# Altium project Capstone_Mainboard.PrjPcb (part 1 of 2)
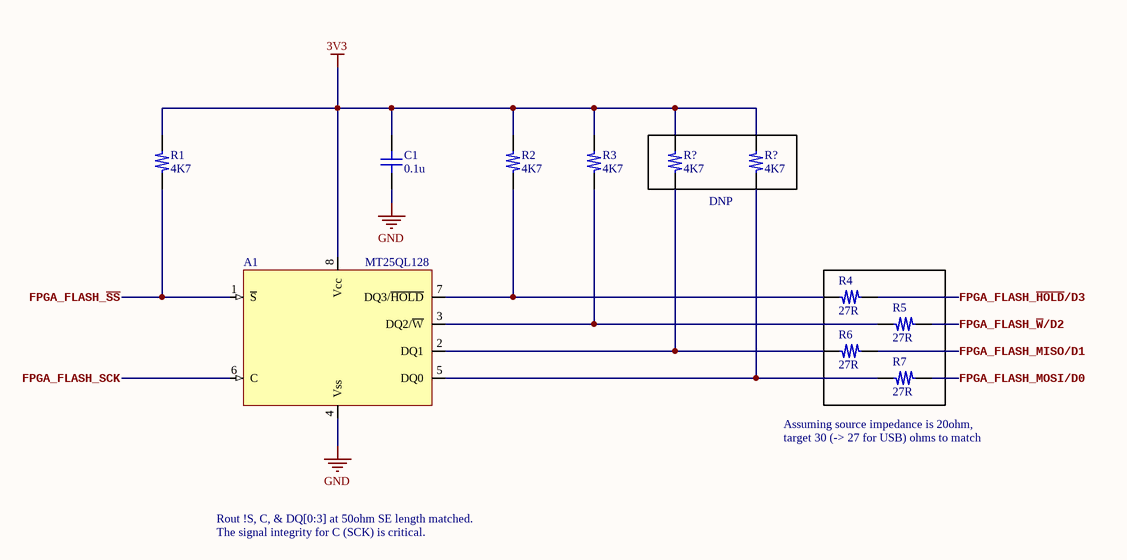
[diagram p0: FPGA_FLASH.SchDoc]
11 sheets, 95 parts. Net scope: global (net labels, ports and power ports of the same name join across sheets).
Board file: Main_PCB.PcbDoc
Sheets:
  FPGA_FLASH.SchDoc
  I2C_Switch_I2C_EEPROM.SchDoc
  QSFP_Cages_Connectors.SchDoc
  HPCC_Connector_A.SchDoc
  HPCC_Connector_B.SchDoc
  FPGA_Power.SchDoc
  FPGA_Configuration_JTAG.SchDoc
  FPGA_HPCC_B_BG13-15-16.SchDoc
  FPGA_HPCC_A_BG33-34-35.SchDoc
  FPGA_GTXqs.SchDoc
  Misc_Functions.SchDoc

## Sheet FPGA_FLASH.SchDoc
size B; SheetNumber: 1; SheetTotal: 11

### Parts
(Parts that share a designator on the sheet are numbered #1, #2 ... from top to bottom, then left to right.)
A1  MT25QL128  [LOTES_ACA-SPI-004-K01]
C1  0.1u  [C_0402_Generic]
R1  4K7  [R_0402_Generic]
R2  4K7  [R_0402_Generic]
R3  4K7  [R_0402_Generic]
R4  27R  [R_0402_Generic]
R5  27R  [R_0402_Generic]
R6  27R  [R_0402_Generic]
R7  27R  [R_0402_Generic]
R?#1  4K7  [R_0402_Generic]
R?#2  4K7  [R_0402_Generic]

### Nets
3V3: A1.8(Vcc) C1.2 R1.2 R2.2 R3.2 R?#1.2 R?#2.2
GND: A1.4(Vss) C1.1
FPGA_FLASH_~{HOLD}/D3: R4.1
FPGA_FLASH_MISO/D1: R6.1
FPGA_FLASH_MOSI/D0: R7.1
FPGA_FLASH_~{SS}: A1.1(~{S}) R1.1
FPGA_FLASH_SCK: A1.6(C)
FPGA_FLASH_~{W}/D2: R5.1
NetA1_2: A1.2(DQ1) R6.2 R?#1.1
NetA1_3: A1.3(DQ2/~{W}) R3.1 R5.2
NetA1_5: A1.5(DQ0) R7.2 R?#2.1
NetA1_7: A1.7(DQ3/~{HOLD}) R2.1 R4.2

### Notes on the sheet
- (near R?#2) DNP
- (near R7) Assuming source impedance is 20ohm,
- target 30 (-> 27 for USB) ohms to match
- Rout !S, C, & DQ[0:3] at 50ohm SE length matched.
- The signal integrity for C (SCK) is critical.

### Library data of the parts
A1 = MT25QL128ABA1ESE_ACA-SPI-004: FLASH - NOR Memory IC 128Mbit SPI (Q)SPI 133 MHz 8-SO In ACA-SPI-004-K01 socket; Manufacturer: Micron Technology Inc; Manufacturer Part Number: MT25QL128ABA1ESE; Manufacturer2: LOTES; Manufacturer2 Part Number: ACA-SPI-004-K01
C1 = GRM155R71C104KA88D: 0.1µF 16V X7R SMD ceramic capacitor in 0402 size; Manufacturer: Murata Electronics; Manufacturer Part Number: GRM155R71C104KA88D
R1-R3 R?#1 R?#2 = ERJ-2RKF4701X: 4.7KOhm 1% 1/10W SMD resistor in 0402 size; Manufacturer: Panasonic; Manufacturer Part Number: ERJ-2RKF4701X
R4-R7 = ERJ-2RKF27R0X: 27Ohm 1% 1/10W SMD resistor in 0402 size; Manufacturer: Panasonic; Manufacturer Part Number: ERJ-2RKF27R0X

## Sheet I2C_Switch_I2C_EEPROM.SchDoc
size B; SheetNumber: 2; SheetTotal: 11
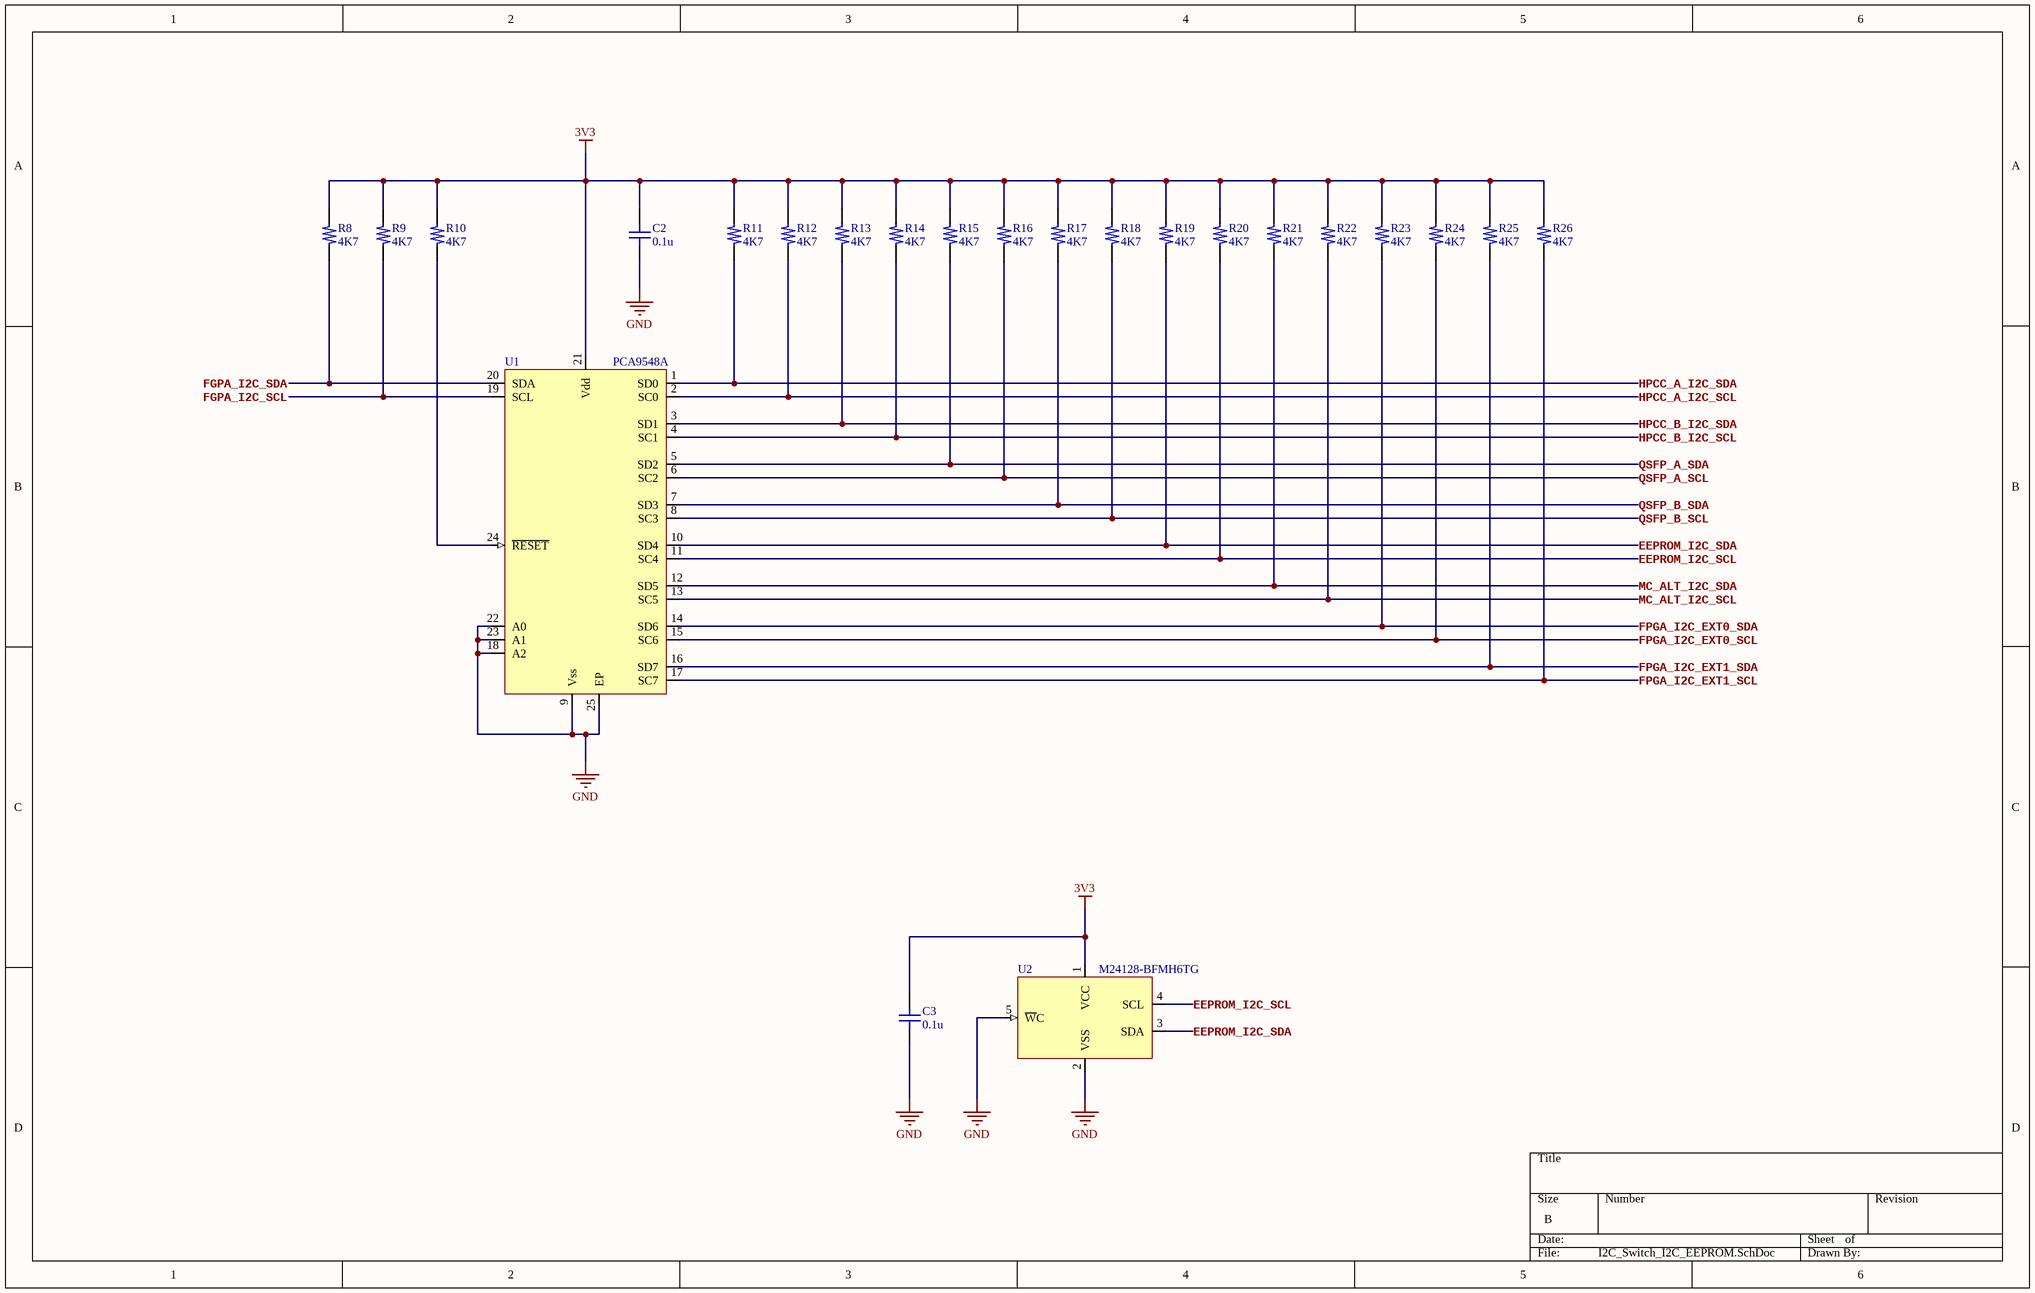
[diagram p1: I2C_Switch_I2C_EEPROM.SchDoc]

### Parts
C2  0.1u  [C_0402_Generic]
C3  0.1u  [C_0402_Generic]
R8  4K7  [R_0402_Generic]
R9  4K7  [R_0402_Generic]
R10  4K7  [R_0402_Generic]
R11  4K7  [R_0402_Generic]
R12  4K7  [R_0402_Generic]
R13  4K7  [R_0402_Generic]
R14  4K7  [R_0402_Generic]
R15  4K7  [R_0402_Generic]
R16  4K7  [R_0402_Generic]
R17  4K7  [R_0402_Generic]
R18  4K7  [R_0402_Generic]
R19  4K7  [R_0402_Generic]
R20  4K7  [R_0402_Generic]
R21  4K7  [R_0402_Generic]
R22  4K7  [R_0402_Generic]
R23  4K7  [R_0402_Generic]
R24  4K7  [R_0402_Generic]
R25  4K7  [R_0402_Generic]
R26  4K7  [R_0402_Generic]
U1  PCA9548A  [HVQFN24_NXP]
U2  M24128-BFMH6TG  [STM_DFN5]

### Nets
3V3: C2.2 C3.2 R8.2 R9.2 R10.2 R11.2 R12.2 R13.2 R14.2 R15.2 R16.2 R17.2 R18.2 R19.2 R20.2 R21.2 R22.2 R23.2 R24.2 R25.2 R26.2 U1.21(Vdd) U2.1(VCC)
GND: C2.1 C3.1 U1.9(Vss) U1.18(A2) U1.22(A0) U1.23(A1) U1.25(EP) U2.2(VSS) U2.5(~{W}C)
EEPROM_I2C_SCL: R20.1 U1.11(SC4) U2.4(SCL)
EEPROM_I2C_SDA: R19.1 U1.10(SD4) U2.3(SDA)
FGPA_I2C_SCL: R9.1 U1.19(SCL)
FGPA_I2C_SDA: R8.1 U1.20(SDA)
FPGA_I2C_EXT0_SCL: R24.1 U1.15(SC6)
FPGA_I2C_EXT0_SDA: R23.1 U1.14(SD6)
FPGA_I2C_EXT1_SCL: R26.1 U1.17(SC7)
FPGA_I2C_EXT1_SDA: R25.1 U1.16(SD7)
HPCC_A_I2C_SCL: R12.1 U1.2(SC0)
HPCC_A_I2C_SDA: R11.1 U1.1(SD0)
HPCC_B_I2C_SCL: R14.1 U1.4(SC1)
HPCC_B_I2C_SDA: R13.1 U1.3(SD1)
MC_ALT_I2C_SCL: R22.1 U1.13(SC5)
MC_ALT_I2C_SDA: R21.1 U1.12(SD5)
QSFP_A_SCL: R16.1 U1.6(SC2)
QSFP_A_SDA: R15.1 U1.5(SD2)
QSFP_B_SCL: R18.1 U1.8(SC3)
QSFP_B_SDA: R17.1 U1.7(SD3)
NetR10_1: R10.1 U1.24(~{RESET})

### Library data of the parts
C2 C3 = GRM155R71C104KA88D: as C1 on sheet FPGA_FLASH; Manufacturer Part Number: GRM155R71C104KA88D
R8-R26 = ERJ-2RKF4701X: as R1 on sheet FPGA_FLASH; Manufacturer Part Number: ERJ-2RKF4701X
U1 = PCA9548ABS,118: 8-channel I 2 C-bus switch, 24-HVQFN; Manufacturer: NXP; Manufacturer Part Number: PCA9548ABS,118
U2 = M24128-BFMH6TG: EEPROM 128Kbit I2C 1MHz 450 ns; Manufacturer: STMicroelectronics; Manufacturer Part Number: M24128-BFMH6TG

## Sheet QSFP_Cages_Connectors.SchDoc
size B; SheetNumber: 3; SheetTotal: 11
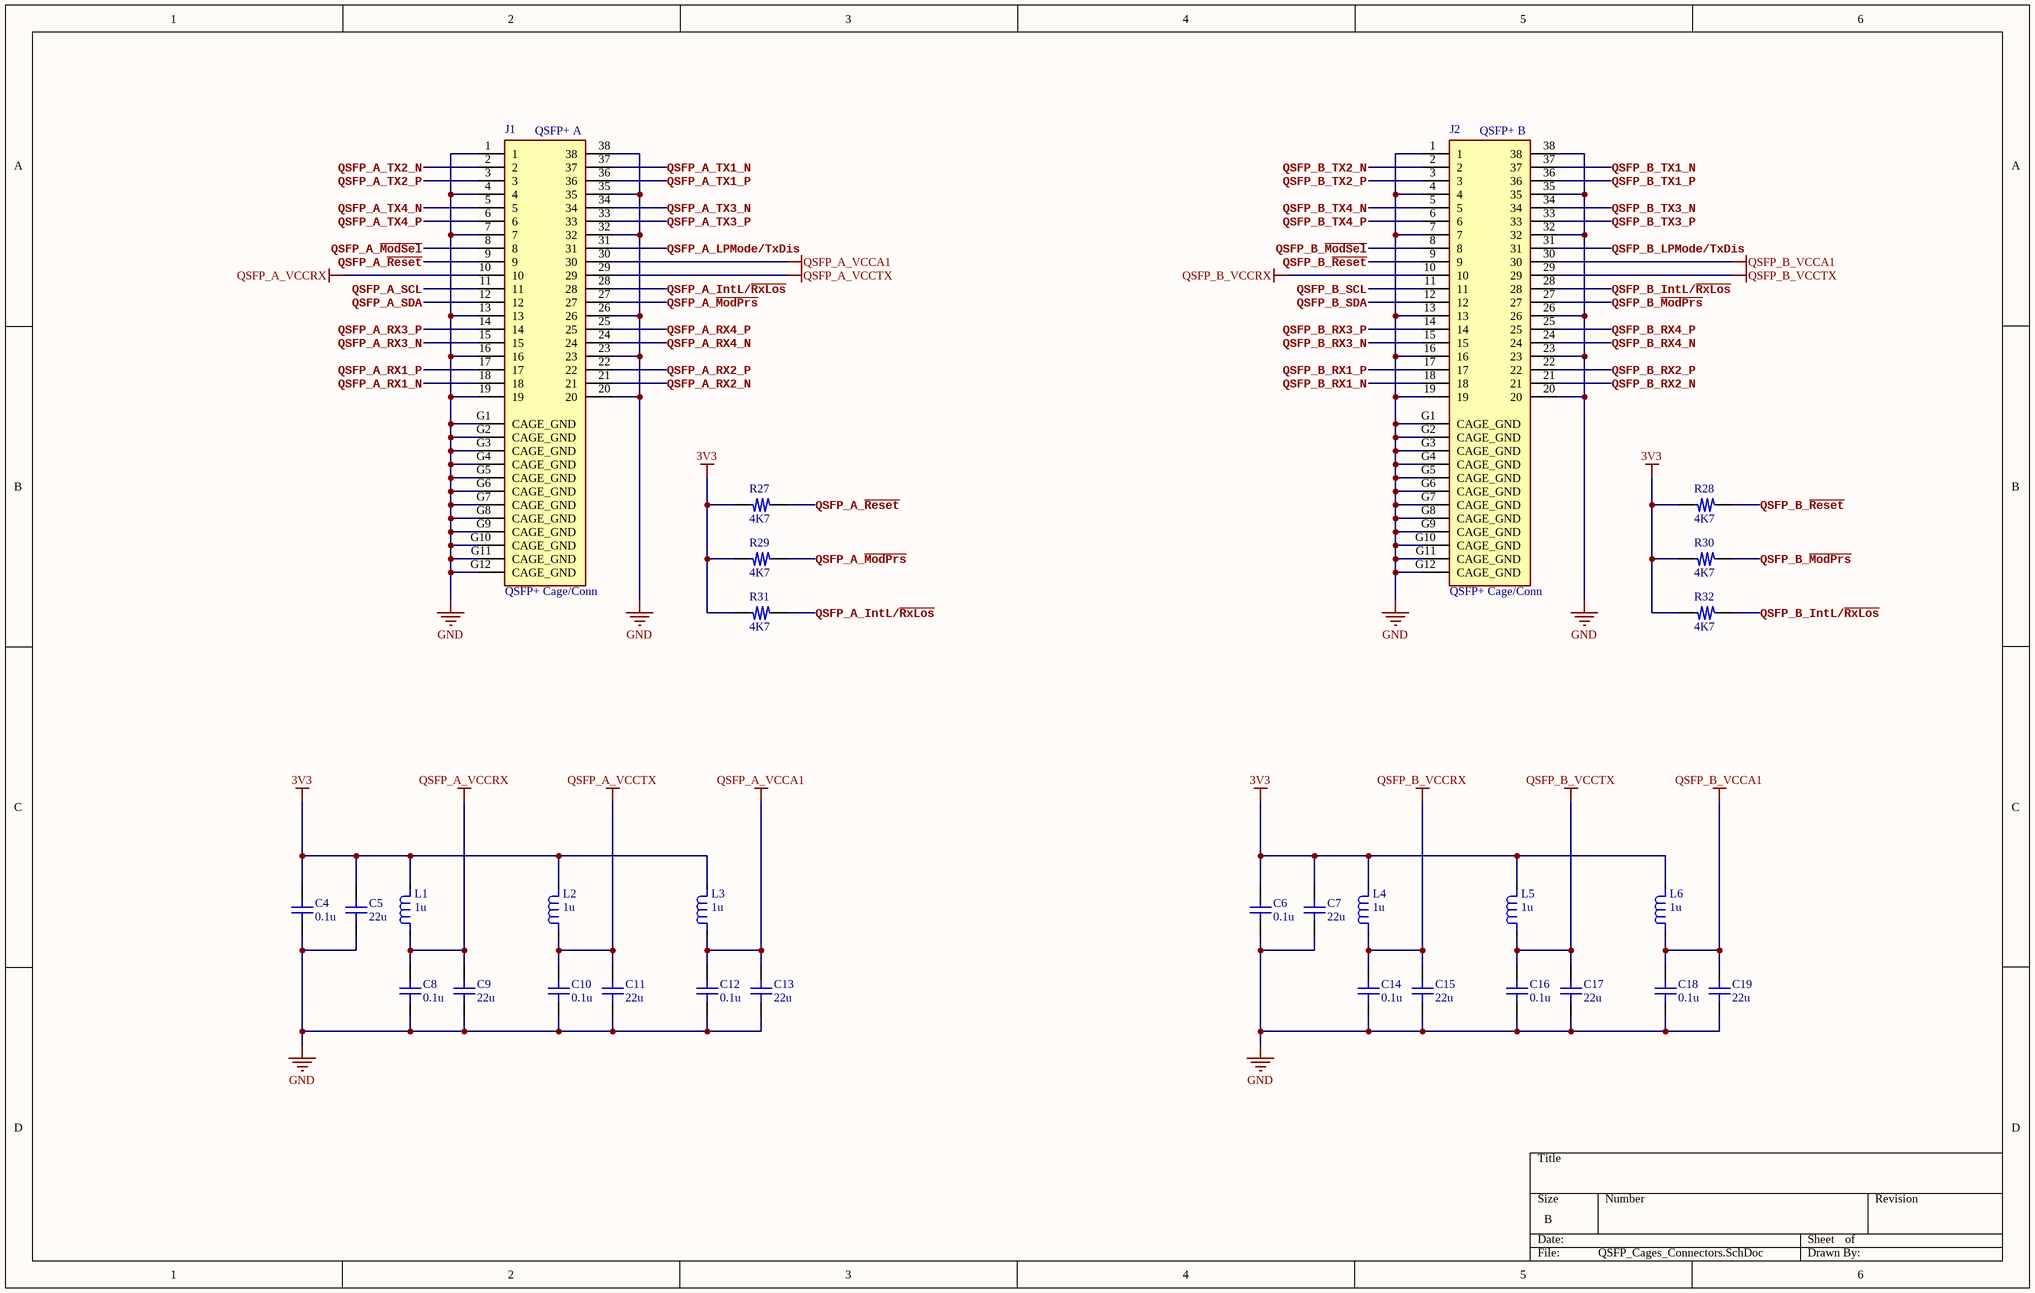
[diagram p2: QSFP_Cages_Connectors.SchDoc]

### Parts
C4  0.1u  [C_0402_Generic]
C5  22u  [C_0603_Generic]
C6  0.1u  [C_0402_Generic]
C7  22u  [C_0603_Generic]
C8  0.1u  [C_0402_Generic]
C9  22u  [C_0603_Generic]
C10  0.1u  [C_0402_Generic]
C11  22u  [C_0603_Generic]
C12  0.1u  [C_0402_Generic]
C13  22u  [C_0603_Generic]
C14  0.1u  [C_0402_Generic]
C15  22u  [C_0603_Generic]
C16  0.1u  [C_0402_Generic]
C17  22u  [C_0603_Generic]
C18  0.1u  [C_0402_Generic]
C19  22u  [C_0603_Generic]
J1  QSFP+ Cage/Conn  [AMPHENOL_U95T151100A]
J2  QSFP+ Cage/Conn  [AMPHENOL_U95T151100A]
L1  1u  [Murata_Ind_1008]
L2  1u  [Murata_Ind_1008]
L3  1u  [Murata_Ind_1008]
L4  1u  [Murata_Ind_1008]
L5  1u  [Murata_Ind_1008]
L6  1u  [Murata_Ind_1008]
R27  4K7  [R_0402_Generic]
R28  4K7  [R_0402_Generic]
R29  4K7  [R_0402_Generic]
R30  4K7  [R_0402_Generic]
R31  4K7  [R_0402_Generic]
R32  4K7  [R_0402_Generic]

### Nets
3V3: C4.2 C5.2 C6.2 C7.2 L1.1 L2.1 L3.1 L4.1 L5.1 L6.1 R27.2 R28.2 R29.2 R30.2 R31.2 R32.2
GND: C4.1 C5.1 C6.1 C7.1 C8.1 C9.1 C10.1 C11.1 C12.1 C13.1 C14.1 C15.1 C16.1 C17.1 C18.1 C19.1 J1.1 J1.4 J1.7 J1.13 J1.16 J1.19 J1.20 J1.23 J1.26 J1.32 J1.35 J1.38 J1.G1(CAGE_GND) J1.G2(CAGE_GND) J1.G3(CAGE_GND) J1.G4(CAGE_GND) J1.G5(CAGE_GND) J1.G6(CAGE_GND) J1.G7(CAGE_GND) J1.G8(CAGE_GND) J1.G9(CAGE_GND) J1.G10(CAGE_GND) J1.G11(CAGE_GND) J1.G12(CAGE_GND) J2.1 J2.4 J2.7 J2.13 J2.16 J2.19 J2.20 J2.23 J2.26 J2.32 J2.35 J2.38 J2.G1(CAGE_GND) J2.G2(CAGE_GND) J2.G3(CAGE_GND) J2.G4(CAGE_GND) J2.G5(CAGE_GND) J2.G6(CAGE_GND) J2.G7(CAGE_GND) J2.G8(CAGE_GND) J2.G9(CAGE_GND) J2.G10(CAGE_GND) J2.G11(CAGE_GND) J2.G12(CAGE_GND)
QSFP_A_VCCA1: C12.2 C13.2 J1.30 L3.2
QSFP_A_VCCRX: C8.2 C9.2 J1.10 L1.2
QSFP_A_VCCTX: C10.2 C11.2 J1.29 L2.2
QSFP_B_VCCA1: C18.2 C19.2 J2.30 L6.2
QSFP_B_VCCRX: C14.2 C15.2 J2.10 L4.2
QSFP_B_VCCTX: C16.2 C17.2 J2.29 L5.2
QSFP_A_IntL/~{RxLos}: J1.28 R31.1
QSFP_A_LPMode/TxDis: J1.31
QSFP_A_~{ModPrs}: J1.27 R29.1
QSFP_A_~{ModSel}: J1.8
QSFP_A_~{Reset}: J1.9 R27.1
QSFP_A_RX1_N: J1.18
QSFP_A_RX1_P: J1.17
QSFP_A_RX2_N: J1.21
QSFP_A_RX2_P: J1.22
QSFP_A_RX3_N: J1.15
QSFP_A_RX3_P: J1.14
QSFP_A_RX4_N: J1.24
QSFP_A_RX4_P: J1.25
QSFP_A_SCL: J1.11
QSFP_A_SDA: J1.12
QSFP_A_TX1_N: J1.37
QSFP_A_TX1_P: J1.36
QSFP_A_TX2_N: J1.2
QSFP_A_TX2_P: J1.3
QSFP_A_TX3_N: J1.34
QSFP_A_TX3_P: J1.33
QSFP_A_TX4_N: J1.5
QSFP_A_TX4_P: J1.6
QSFP_B_IntL/~{RxLos}: J2.28 R32.1
QSFP_B_LPMode/TxDis: J2.31
QSFP_B_~{ModPrs}: J2.27 R30.1
QSFP_B_~{ModSel}: J2.8
QSFP_B_~{Reset}: J2.9 R28.1
QSFP_B_RX1_N: J2.18
QSFP_B_RX1_P: J2.17
QSFP_B_RX2_N: J2.21
QSFP_B_RX2_P: J2.22
QSFP_B_RX3_N: J2.15
QSFP_B_RX3_P: J2.14
QSFP_B_RX4_N: J2.24
QSFP_B_RX4_P: J2.25
QSFP_B_SCL: J2.11
QSFP_B_SDA: J2.12
QSFP_B_TX1_N: J2.37
QSFP_B_TX1_P: J2.36
QSFP_B_TX2_N: J2.2
QSFP_B_TX2_P: J2.3
QSFP_B_TX3_N: J2.34
QSFP_B_TX3_P: J2.33
QSFP_B_TX4_N: J2.5
QSFP_B_TX4_P: J2.6

### Notes on the sheet
- (near J1) QSFP+ A
- (near J2) QSFP+ B

### Library data of the parts
C4 C6 C8 C10 C12 C14 C16 C18 = GRM155R71C104KA88D: as C1 on sheet FPGA_FLASH; Manufacturer Part Number: GRM155R71C104KA88D
C5 C7 C9 C11 C13 C15 C17 C19 = GRM188R60J226MEA0D: 22µF 6.3V X5R SMD ceramic capacitor in 0603 size; Manufacturer: Murata Electronics; Manufacturer Part Number: GRM188R60J226MEA0D
J1 J2 = U95T151100A: NOTE: Notes Also uses one FS1-Z38-20Z6-60. 38 Position QSFP+ Receptacle; MF: Amphenol; Package: None; Availability: In Stock; SnapEDA_Link: https://www.snapeda.com/parts/U95T151100A/Amphenol/view-part/?ref=snap; MP: U95T151100A; Price: None; Check_prices: https://www.snapeda.com/parts/U95T151100A/Amphenol/view-part/?ref=eda; Purchase-URL: https://pricing.snapeda.com/search/part/U95T151100A/?ref=eda; Value: *
L1-L6 = DFE252012F-1R0M=P2: 1µH Shielded 3.3A 40mOhm 1008 Inductor; Manufacturer: Murata Electronics; Manufacturer Part Number: DFE252012F-1R0M=P2
R27-R32 = ERJ-2RKF4701X: as R1 on sheet FPGA_FLASH; Manufacturer Part Number: ERJ-2RKF4701X

## Sheet HPCC_Connector_A.SchDoc
size B; SheetNumber: 4; SheetTotal: 11
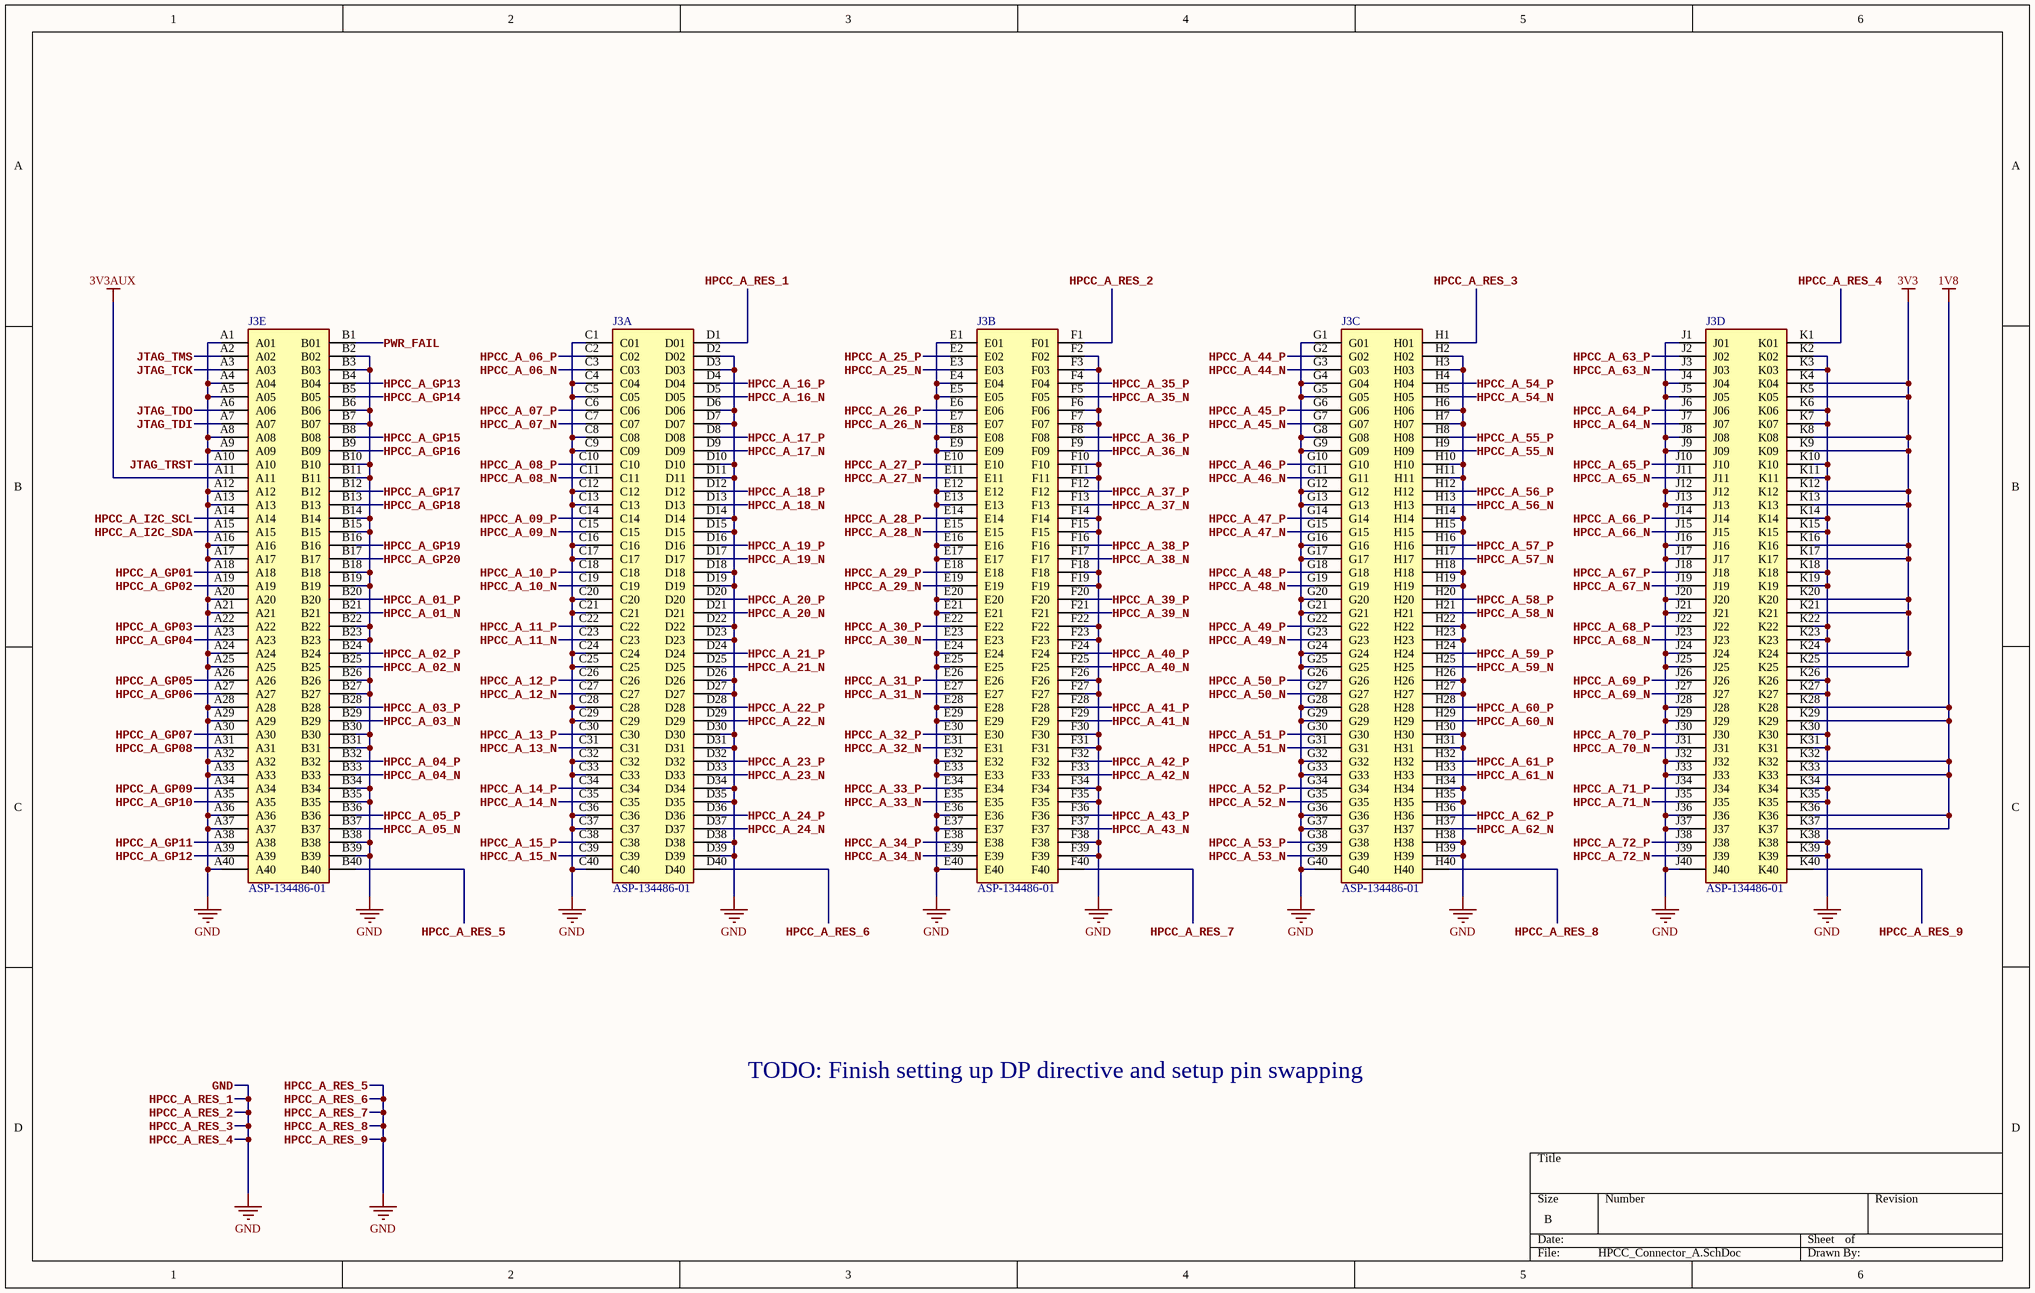
[diagram p3: HPCC_Connector_A.SchDoc]

### Parts
J3  ASP-134486-01  [SAMTEC_ASP-134486-01]  (parts A,B,C,D,E of 5)

### Nets
1V8: J3.K28 J3.K29 J3.K32 J3.K33 J3.K36 J3.K37
3V3: J3.K4(K04) J3.K5(K05) J3.K8(K08) J3.K9(K09) J3.K12 J3.K13 J3.K16 J3.K17 J3.K20 J3.K21 J3.K24 J3.K25
3V3AUX: J3.A11
GND: J3.A1(A01) J3.A4(A04) J3.A5(A05) J3.A8(A08) J3.A9(A09) J3.A12 J3.A13 J3.A16 J3.A17 J3.A20 J3.A21 J3.A24 J3.A25 J3.A28 J3.A29 J3.A32 J3.A33 J3.A36 J3.A37 J3.A40 J3.B2(B02) J3.B3(B03) J3.B6(B06) J3.B7(B07) J3.B10 J3.B11 J3.B14 J3.B15 J3.B18 J3.B19 J3.B22 J3.B23 J3.B26 J3.B27 J3.B30 J3.B31 J3.B34 J3.B35 J3.B38 J3.B39 J3.B40 J3.C1(C01) J3.C4(C04) J3.C5(C05) J3.C8(C08) J3.C9(C09) J3.C12 J3.C13 J3.C16 J3.C17 J3.C20 J3.C21 J3.C24 J3.C25 J3.C28 J3.C29 J3.C32 J3.C33 J3.C36 J3.C37 J3.C40 J3.D1(D01) J3.D2(D02) J3.D3(D03) J3.D6(D06) J3.D7(D07) J3.D10 J3.D11 J3.D14 J3.D15 J3.D18 J3.D19 J3.D22 J3.D23 J3.D26 J3.D27 J3.D30 J3.D31 J3.D34 J3.D35 J3.D38 J3.D39 J3.D40 J3.E1(E01) J3.E4(E04) J3.E5(E05) J3.E8(E08) J3.E9(E09) J3.E12 J3.E13 J3.E16 J3.E17 J3.E20 J3.E21 J3.E24 J3.E25 J3.E28 J3.E29 J3.E32 J3.E33 J3.E36 J3.E37 J3.E40 J3.F1(F01) J3.F2(F02) J3.F3(F03) J3.F6(F06) J3.F7(F07) J3.F10 J3.F11 J3.F14 J3.F15 J3.F18 J3.F19 J3.F22 J3.F23 J3.F26 J3.F27 J3.F30 J3.F31 J3.F34 J3.F35 J3.F38 J3.F39 J3.F40 J3.G1(G01) J3.G4(G04) J3.G5(G05) J3.G8(G08) J3.G9(G09) J3.G12 J3.G13 J3.G16 J3.G17 J3.G20 J3.G21 J3.G24 J3.G25 J3.G28 J3.G29 J3.G32 J3.G33 J3.G36 J3.G37 J3.G40 J3.H1(H01) J3.H2(H02) J3.H3(H03) J3.H6(H06) J3.H7(H07) J3.H10 J3.H11 J3.H14 J3.H15 J3.H18 J3.H19 J3.H22 J3.H23 J3.H26 J3.H27 J3.H30 J3.H31 J3.H34 J3.H35 J3.H38 J3.H39 J3.H40 J3.J1(J01) J3.J4(J04) J3.J5(J05) J3.J8(J08) J3.J9(J09) J3.J12 J3.J13 J3.J16 J3.J17 J3.J20 J3.J21 J3.J24 J3.J25 J3.J28 J3.J29 J3.J32 J3.J33 J3.J36 J3.J37 J3.J40 J3.K1(K01) J3.K2(K02) J3.K3(K03) J3.K6(K06) J3.K7(K07) J3.K10 J3.K11 J3.K14 J3.K15 J3.K18 J3.K19 J3.K22 J3.K23 J3.K26 J3.K27 J3.K30 J3.K31 J3.K34 J3.K35 J3.K38 J3.K39 J3.K40  [also labelled HPCC_A_RES_1, HPCC_A_RES_2, HPCC_A_RES_3, HPCC_A_RES_4, HPCC_A_RES_5, HPCC_A_RES_6, HPCC_A_RES_7, HPCC_A_RES_8, HPCC_A_RES_9]
HPCC_A_01_N: J3.B21
HPCC_A_01_P: J3.B20
HPCC_A_02_N: J3.B25
HPCC_A_02_P: J3.B24
HPCC_A_03_N: J3.B29
HPCC_A_03_P: J3.B28
HPCC_A_04_N: J3.B33
HPCC_A_04_P: J3.B32
HPCC_A_05_N: J3.B37
HPCC_A_05_P: J3.B36
HPCC_A_06_N: J3.C3(C03)
HPCC_A_06_P: J3.C2(C02)
HPCC_A_07_N: J3.C7(C07)
HPCC_A_07_P: J3.C6(C06)
HPCC_A_08_N: J3.C11
HPCC_A_08_P: J3.C10
HPCC_A_09_N: J3.C15
HPCC_A_09_P: J3.C14
HPCC_A_10_N: J3.C19
HPCC_A_10_P: J3.C18
HPCC_A_11_N: J3.C23
HPCC_A_11_P: J3.C22
HPCC_A_12_N: J3.C27
HPCC_A_12_P: J3.C26
HPCC_A_13_N: J3.C31
HPCC_A_13_P: J3.C30
HPCC_A_14_N: J3.C35
HPCC_A_14_P: J3.C34
HPCC_A_15_N: J3.C39
HPCC_A_15_P: J3.C38
HPCC_A_16_N: J3.D5(D05)
HPCC_A_16_P: J3.D4(D04)
HPCC_A_17_N: J3.D9(D09)
HPCC_A_17_P: J3.D8(D08)
HPCC_A_18_N: J3.D13
HPCC_A_18_P: J3.D12
HPCC_A_19_N: J3.D17
HPCC_A_19_P: J3.D16
HPCC_A_20_N: J3.D21
HPCC_A_20_P: J3.D20
HPCC_A_21_N: J3.D25
HPCC_A_21_P: J3.D24
HPCC_A_22_N: J3.D29
HPCC_A_22_P: J3.D28
HPCC_A_23_N: J3.D33
HPCC_A_23_P: J3.D32
HPCC_A_24_N: J3.D37
HPCC_A_24_P: J3.D36
HPCC_A_25_N: J3.E3(E03)
HPCC_A_25_P: J3.E2(E02)
HPCC_A_26_N: J3.E7(E07)
HPCC_A_26_P: J3.E6(E06)
HPCC_A_27_N: J3.E11
HPCC_A_27_P: J3.E10
HPCC_A_28_N: J3.E15
HPCC_A_28_P: J3.E14
HPCC_A_29_N: J3.E19
HPCC_A_29_P: J3.E18
HPCC_A_30_N: J3.E23
HPCC_A_30_P: J3.E22
HPCC_A_31_N: J3.E27
HPCC_A_31_P: J3.E26
HPCC_A_32_N: J3.E31
HPCC_A_32_P: J3.E30
HPCC_A_33_N: J3.E35
HPCC_A_33_P: J3.E34
HPCC_A_34_N: J3.E39
HPCC_A_34_P: J3.E38
HPCC_A_35_N: J3.F5(F05)
HPCC_A_35_P: J3.F4(F04)
HPCC_A_36_N: J3.F9(F09)
HPCC_A_36_P: J3.F8(F08)
HPCC_A_37_N: J3.F13
HPCC_A_37_P: J3.F12
HPCC_A_38_N: J3.F17
HPCC_A_38_P: J3.F16
HPCC_A_39_N: J3.F21
HPCC_A_39_P: J3.F20
HPCC_A_40_N: J3.F25
HPCC_A_40_P: J3.F24
HPCC_A_41_N: J3.F29
HPCC_A_41_P: J3.F28
HPCC_A_42_N: J3.F33
HPCC_A_42_P: J3.F32
HPCC_A_43_N: J3.F37
HPCC_A_43_P: J3.F36
HPCC_A_44_N: J3.G3(G03)
HPCC_A_44_P: J3.G2(G02)
HPCC_A_45_N: J3.G7(G07)
HPCC_A_45_P: J3.G6(G06)
HPCC_A_46_N: J3.G11
HPCC_A_46_P: J3.G10
HPCC_A_47_N: J3.G15
HPCC_A_47_P: J3.G14
HPCC_A_48_N: J3.G19
HPCC_A_48_P: J3.G18
HPCC_A_49_N: J3.G23
HPCC_A_49_P: J3.G22
HPCC_A_50_N: J3.G27
HPCC_A_50_P: J3.G26
HPCC_A_51_N: J3.G31
HPCC_A_51_P: J3.G30
HPCC_A_52_N: J3.G35
HPCC_A_52_P: J3.G34
HPCC_A_53_N: J3.G39
HPCC_A_53_P: J3.G38
HPCC_A_54_N: J3.H5(H05)
HPCC_A_54_P: J3.H4(H04)
HPCC_A_55_N: J3.H9(H09)
HPCC_A_55_P: J3.H8(H08)
HPCC_A_56_N: J3.H13
HPCC_A_56_P: J3.H12
HPCC_A_57_N: J3.H17
HPCC_A_57_P: J3.H16
HPCC_A_58_N: J3.H21
HPCC_A_58_P: J3.H20
HPCC_A_59_N: J3.H25
HPCC_A_59_P: J3.H24
HPCC_A_60_N: J3.H29
HPCC_A_60_P: J3.H28
HPCC_A_61_N: J3.H33
HPCC_A_61_P: J3.H32
HPCC_A_62_N: J3.H37
HPCC_A_62_P: J3.H36
HPCC_A_63_N: J3.J3(J03)
HPCC_A_63_P: J3.J2(J02)
HPCC_A_64_N: J3.J7(J07)
HPCC_A_64_P: J3.J6(J06)
HPCC_A_65_N: J3.J11
HPCC_A_65_P: J3.J10
HPCC_A_66_N: J3.J15
HPCC_A_66_P: J3.J14
HPCC_A_67_N: J3.J19
HPCC_A_67_P: J3.J18
HPCC_A_68_N: J3.J23
HPCC_A_68_P: J3.J22
HPCC_A_69_N: J3.J27
HPCC_A_69_P: J3.J26
HPCC_A_70_N: J3.J31
HPCC_A_70_P: J3.J30
HPCC_A_71_N: J3.J35
HPCC_A_71_P: J3.J34
HPCC_A_72_N: J3.J39
HPCC_A_72_P: J3.J38
HPCC_A_GP01: J3.A18
HPCC_A_GP02: J3.A19
HPCC_A_GP03: J3.A22
HPCC_A_GP04: J3.A23
HPCC_A_GP05: J3.A26
HPCC_A_GP06: J3.A27
HPCC_A_GP07: J3.A30
HPCC_A_GP08: J3.A31
HPCC_A_GP09: J3.A34
HPCC_A_GP10: J3.A35
HPCC_A_GP11: J3.A38
HPCC_A_GP12: J3.A39
HPCC_A_GP13: J3.B4(B04)
HPCC_A_GP14: J3.B5(B05)
HPCC_A_GP15: J3.B8(B08)
HPCC_A_GP16: J3.B9(B09)
HPCC_A_GP17: J3.B12
HPCC_A_GP18: J3.B13
HPCC_A_GP19: J3.B16
HPCC_A_GP20: J3.B17
HPCC_A_I2C_SCL: J3.A14
HPCC_A_I2C_SDA: J3.A15
JTAG_TCK: J3.A3(A03)
JTAG_TDI: J3.A7(A07)
JTAG_TDO: J3.A6(A06)
JTAG_TMS: J3.A2(A02)
JTAG_TRST: J3.A10
PWR_FAIL: J3.B1(B01)

### Notes on the sheet
- TODO: Finish setting up DP directive and setup pin swapping

### Library data of the parts
J3 = ASP-134486-01: 400 Position Connector Array, Female Sockets Surface Mount Gold; Manufacturer: Samtec; Manufacturer Part Number: ASP-134486-01

## Sheet HPCC_Connector_B.SchDoc
size B; SheetNumber: 5; SheetTotal: 11
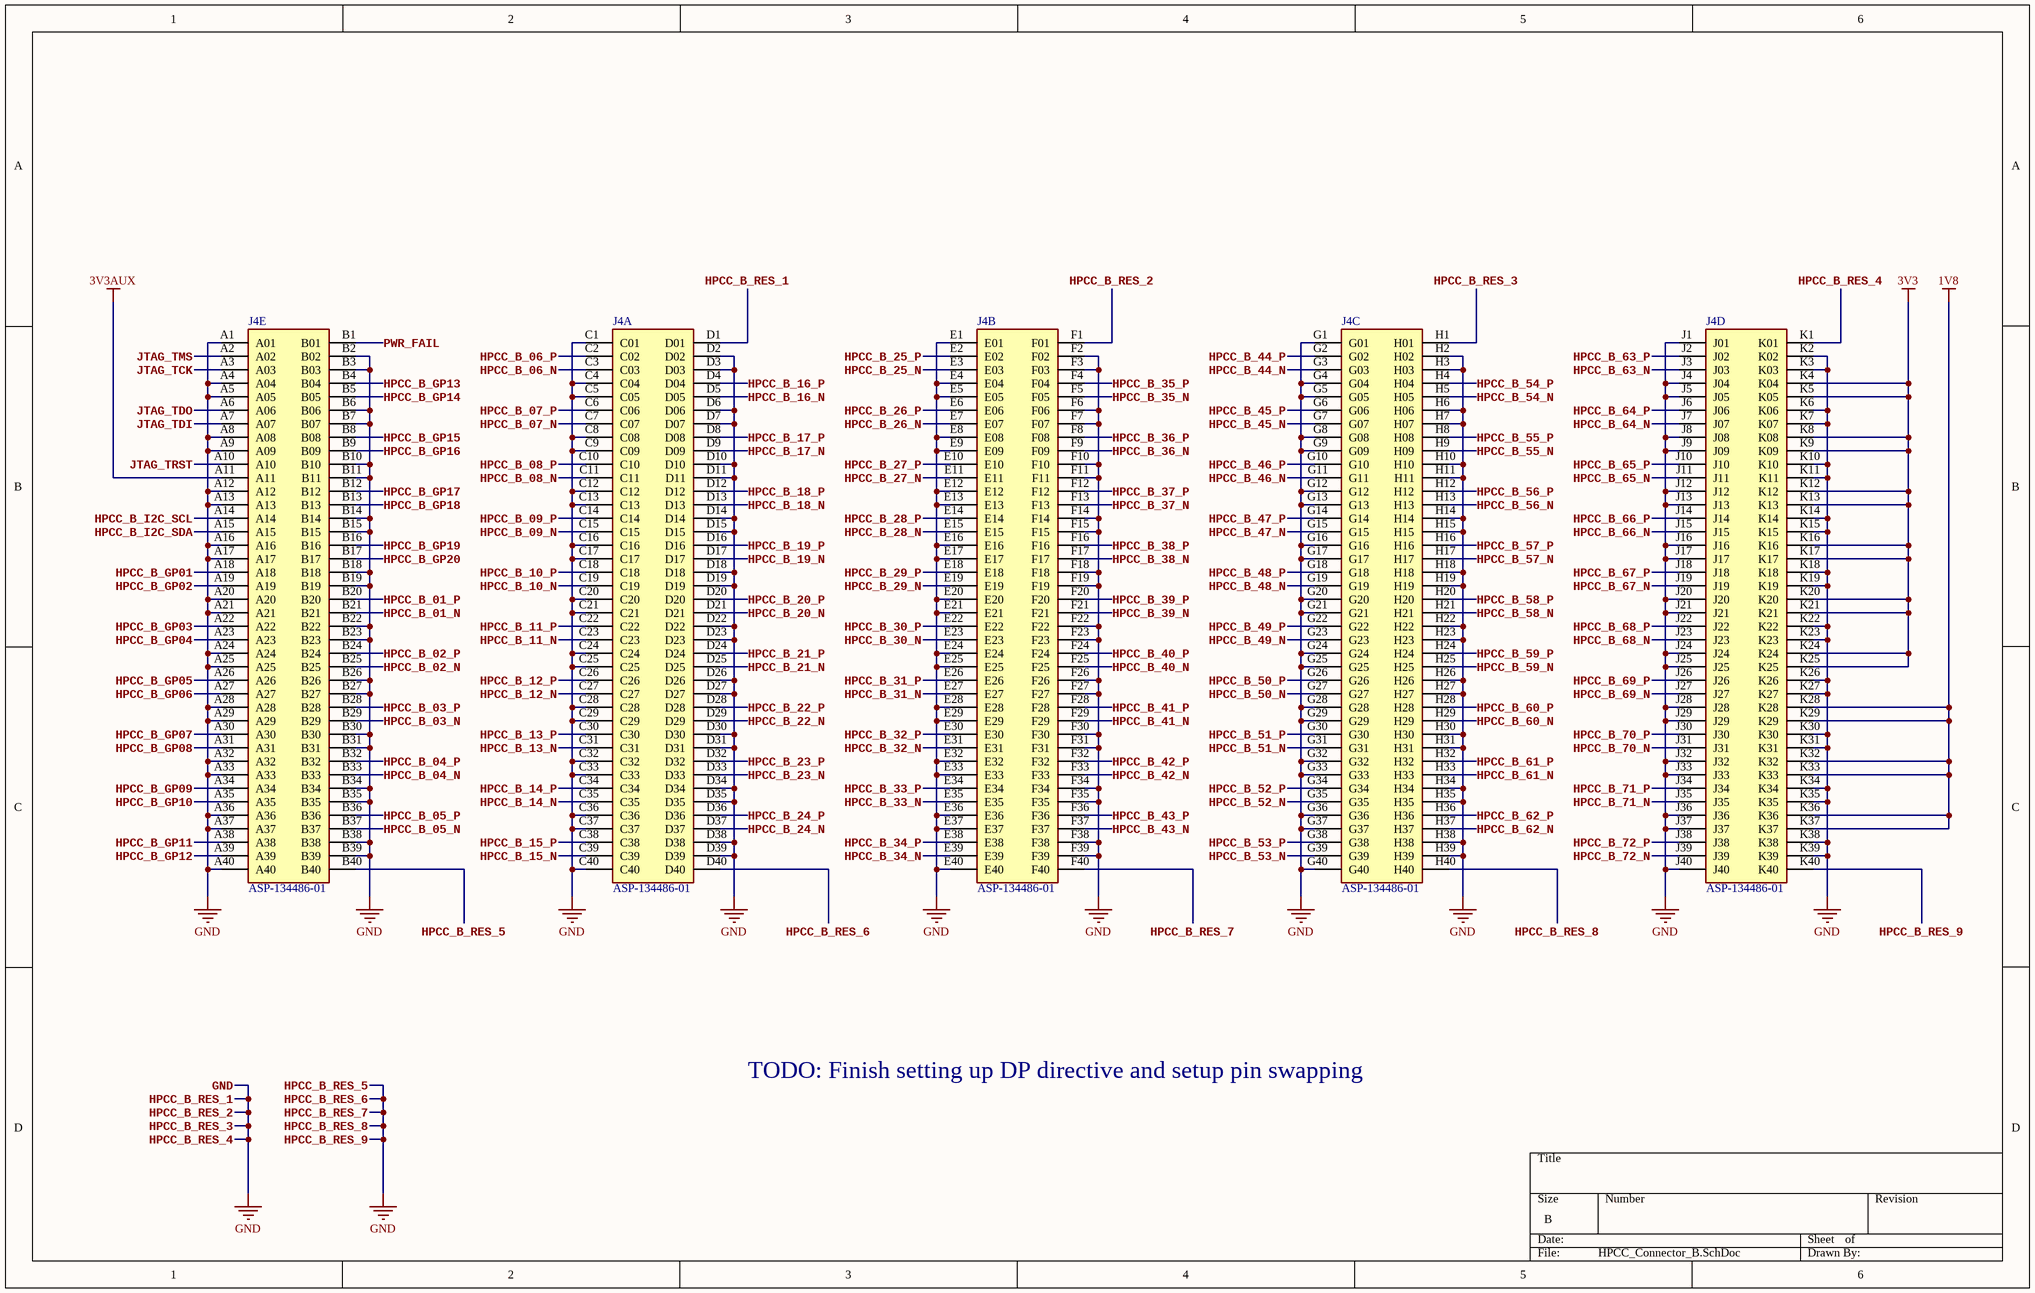
[diagram p4: HPCC_Connector_B.SchDoc]

### Parts
J4  ASP-134486-01  [SAMTEC_ASP-134486-01]  (parts A,B,C,D,E of 5)

### Nets
1V8: J4.K28 J4.K29 J4.K32 J4.K33 J4.K36 J4.K37
3V3: J4.K4(K04) J4.K5(K05) J4.K8(K08) J4.K9(K09) J4.K12 J4.K13 J4.K16 J4.K17 J4.K20 J4.K21 J4.K24 J4.K25
3V3AUX: J4.A11
GND: J4.A1(A01) J4.A4(A04) J4.A5(A05) J4.A8(A08) J4.A9(A09) J4.A12 J4.A13 J4.A16 J4.A17 J4.A20 J4.A21 J4.A24 J4.A25 J4.A28 J4.A29 J4.A32 J4.A33 J4.A36 J4.A37 J4.A40 J4.B2(B02) J4.B3(B03) J4.B6(B06) J4.B7(B07) J4.B10 J4.B11 J4.B14 J4.B15 J4.B18 J4.B19 J4.B22 J4.B23 J4.B26 J4.B27 J4.B30 J4.B31 J4.B34 J4.B35 J4.B38 J4.B39 J4.B40 J4.C1(C01) J4.C4(C04) J4.C5(C05) J4.C8(C08) J4.C9(C09) J4.C12 J4.C13 J4.C16 J4.C17 J4.C20 J4.C21 J4.C24 J4.C25 J4.C28 J4.C29 J4.C32 J4.C33 J4.C36 J4.C37 J4.C40 J4.D1(D01) J4.D2(D02) J4.D3(D03) J4.D6(D06) J4.D7(D07) J4.D10 J4.D11 J4.D14 J4.D15 J4.D18 J4.D19 J4.D22 J4.D23 J4.D26 J4.D27 J4.D30 J4.D31 J4.D34 J4.D35 J4.D38 J4.D39 J4.D40 J4.E1(E01) J4.E4(E04) J4.E5(E05) J4.E8(E08) J4.E9(E09) J4.E12 J4.E13 J4.E16 J4.E17 J4.E20 J4.E21 J4.E24 J4.E25 J4.E28 J4.E29 J4.E32 J4.E33 J4.E36 J4.E37 J4.E40 J4.F1(F01) J4.F2(F02) J4.F3(F03) J4.F6(F06) J4.F7(F07) J4.F10 J4.F11 J4.F14 J4.F15 J4.F18 J4.F19 J4.F22 J4.F23 J4.F26 J4.F27 J4.F30 J4.F31 J4.F34 J4.F35 J4.F38 J4.F39 J4.F40 J4.G1(G01) J4.G4(G04) J4.G5(G05) J4.G8(G08) J4.G9(G09) J4.G12 J4.G13 J4.G16 J4.G17 J4.G20 J4.G21 J4.G24 J4.G25 J4.G28 J4.G29 J4.G32 J4.G33 J4.G36 J4.G37 J4.G40 J4.H1(H01) J4.H2(H02) J4.H3(H03) J4.H6(H06) J4.H7(H07) J4.H10 J4.H11 J4.H14 J4.H15 J4.H18 J4.H19 J4.H22 J4.H23 J4.H26 J4.H27 J4.H30 J4.H31 J4.H34 J4.H35 J4.H38 J4.H39 J4.H40 J4.J1(J01) J4.J4(J04) J4.J5(J05) J4.J8(J08) J4.J9(J09) J4.J12 J4.J13 J4.J16 J4.J17 J4.J20 J4.J21 J4.J24 J4.J25 J4.J28 J4.J29 J4.J32 J4.J33 J4.J36 J4.J37 J4.J40 J4.K1(K01) J4.K2(K02) J4.K3(K03) J4.K6(K06) J4.K7(K07) J4.K10 J4.K11 J4.K14 J4.K15 J4.K18 J4.K19 J4.K22 J4.K23 J4.K26 J4.K27 J4.K30 J4.K31 J4.K34 J4.K35 J4.K38 J4.K39 J4.K40  [also labelled HPCC_B_RES_1, HPCC_B_RES_2, HPCC_B_RES_3, HPCC_B_RES_4, HPCC_B_RES_5, HPCC_B_RES_6, HPCC_B_RES_7, HPCC_B_RES_8, HPCC_B_RES_9]
HPCC_B_01_N: J4.B21
HPCC_B_01_P: J4.B20
HPCC_B_02_N: J4.B25
HPCC_B_02_P: J4.B24
HPCC_B_03_N: J4.B29
HPCC_B_03_P: J4.B28
HPCC_B_04_N: J4.B33
HPCC_B_04_P: J4.B32
HPCC_B_05_N: J4.B37
HPCC_B_05_P: J4.B36
HPCC_B_06_N: J4.C3(C03)
HPCC_B_06_P: J4.C2(C02)
HPCC_B_07_N: J4.C7(C07)
HPCC_B_07_P: J4.C6(C06)
HPCC_B_08_N: J4.C11
HPCC_B_08_P: J4.C10
HPCC_B_09_N: J4.C15
HPCC_B_09_P: J4.C14
HPCC_B_10_N: J4.C19
HPCC_B_10_P: J4.C18
HPCC_B_11_N: J4.C23
HPCC_B_11_P: J4.C22
HPCC_B_12_N: J4.C27
HPCC_B_12_P: J4.C26
HPCC_B_13_N: J4.C31
HPCC_B_13_P: J4.C30
HPCC_B_14_N: J4.C35
HPCC_B_14_P: J4.C34
HPCC_B_15_N: J4.C39
HPCC_B_15_P: J4.C38
HPCC_B_16_N: J4.D5(D05)
HPCC_B_16_P: J4.D4(D04)
HPCC_B_17_N: J4.D9(D09)
HPCC_B_17_P: J4.D8(D08)
HPCC_B_18_N: J4.D13
HPCC_B_18_P: J4.D12
HPCC_B_19_N: J4.D17
HPCC_B_19_P: J4.D16
HPCC_B_20_N: J4.D21
HPCC_B_20_P: J4.D20
HPCC_B_21_N: J4.D25
HPCC_B_21_P: J4.D24
HPCC_B_22_N: J4.D29
HPCC_B_22_P: J4.D28
HPCC_B_23_N: J4.D33
HPCC_B_23_P: J4.D32
HPCC_B_24_N: J4.D37
HPCC_B_24_P: J4.D36
HPCC_B_25_N: J4.E3(E03)
HPCC_B_25_P: J4.E2(E02)
HPCC_B_26_N: J4.E7(E07)
HPCC_B_26_P: J4.E6(E06)
HPCC_B_27_N: J4.E11
HPCC_B_27_P: J4.E10
HPCC_B_28_N: J4.E15
HPCC_B_28_P: J4.E14
HPCC_B_29_N: J4.E19
HPCC_B_29_P: J4.E18
HPCC_B_30_N: J4.E23
HPCC_B_30_P: J4.E22
HPCC_B_31_N: J4.E27
HPCC_B_31_P: J4.E26
HPCC_B_32_N: J4.E31
HPCC_B_32_P: J4.E30
HPCC_B_33_N: J4.E35
HPCC_B_33_P: J4.E34
HPCC_B_34_N: J4.E39
HPCC_B_34_P: J4.E38
HPCC_B_35_N: J4.F5(F05)
HPCC_B_35_P: J4.F4(F04)
HPCC_B_36_N: J4.F9(F09)
HPCC_B_36_P: J4.F8(F08)
HPCC_B_37_N: J4.F13
HPCC_B_37_P: J4.F12
HPCC_B_38_N: J4.F17
HPCC_B_38_P: J4.F16
HPCC_B_39_N: J4.F21
HPCC_B_39_P: J4.F20
HPCC_B_40_N: J4.F25
HPCC_B_40_P: J4.F24
HPCC_B_41_N: J4.F29
HPCC_B_41_P: J4.F28
HPCC_B_42_N: J4.F33
HPCC_B_42_P: J4.F32
HPCC_B_43_N: J4.F37
HPCC_B_43_P: J4.F36
HPCC_B_44_N: J4.G3(G03)
HPCC_B_44_P: J4.G2(G02)
HPCC_B_45_N: J4.G7(G07)
HPCC_B_45_P: J4.G6(G06)
HPCC_B_46_N: J4.G11
HPCC_B_46_P: J4.G10
HPCC_B_47_N: J4.G15
HPCC_B_47_P: J4.G14
HPCC_B_48_N: J4.G19
HPCC_B_48_P: J4.G18
HPCC_B_49_N: J4.G23
HPCC_B_49_P: J4.G22
HPCC_B_50_N: J4.G27
HPCC_B_50_P: J4.G26
HPCC_B_51_N: J4.G31
HPCC_B_51_P: J4.G30
HPCC_B_52_N: J4.G35
HPCC_B_52_P: J4.G34
HPCC_B_53_N: J4.G39
HPCC_B_53_P: J4.G38
HPCC_B_54_N: J4.H5(H05)
HPCC_B_54_P: J4.H4(H04)
HPCC_B_55_N: J4.H9(H09)
HPCC_B_55_P: J4.H8(H08)
HPCC_B_56_N: J4.H13
HPCC_B_56_P: J4.H12
HPCC_B_57_N: J4.H17
HPCC_B_57_P: J4.H16
HPCC_B_58_N: J4.H21
HPCC_B_58_P: J4.H20
HPCC_B_59_N: J4.H25
HPCC_B_59_P: J4.H24
HPCC_B_60_N: J4.H29
HPCC_B_60_P: J4.H28
HPCC_B_61_N: J4.H33
HPCC_B_61_P: J4.H32
HPCC_B_62_N: J4.H37
HPCC_B_62_P: J4.H36
HPCC_B_63_N: J4.J3(J03)
HPCC_B_63_P: J4.J2(J02)
HPCC_B_64_N: J4.J7(J07)
HPCC_B_64_P: J4.J6(J06)
HPCC_B_65_N: J4.J11
HPCC_B_65_P: J4.J10
HPCC_B_66_N: J4.J15
HPCC_B_66_P: J4.J14
HPCC_B_67_N: J4.J19
HPCC_B_67_P: J4.J18
HPCC_B_68_N: J4.J23
HPCC_B_68_P: J4.J22
HPCC_B_69_N: J4.J27
HPCC_B_69_P: J4.J26
HPCC_B_70_N: J4.J31
HPCC_B_70_P: J4.J30
HPCC_B_71_N: J4.J35
HPCC_B_71_P: J4.J34
HPCC_B_72_N: J4.J39
HPCC_B_72_P: J4.J38
HPCC_B_GP01: J4.A18
HPCC_B_GP02: J4.A19
HPCC_B_GP03: J4.A22
HPCC_B_GP04: J4.A23
HPCC_B_GP05: J4.A26
HPCC_B_GP06: J4.A27
HPCC_B_GP07: J4.A30
HPCC_B_GP08: J4.A31
HPCC_B_GP09: J4.A34
HPCC_B_GP10: J4.A35
HPCC_B_GP11: J4.A38
HPCC_B_GP12: J4.A39
HPCC_B_GP13: J4.B4(B04)
HPCC_B_GP14: J4.B5(B05)
HPCC_B_GP15: J4.B8(B08)
HPCC_B_GP16: J4.B9(B09)
HPCC_B_GP17: J4.B12
HPCC_B_GP18: J4.B13
HPCC_B_GP19: J4.B16
HPCC_B_GP20: J4.B17
HPCC_B_I2C_SCL: J4.A14
HPCC_B_I2C_SDA: J4.A15
JTAG_TCK: J4.A3(A03)
JTAG_TDI: J4.A7(A07)
JTAG_TDO: J4.A6(A06)
JTAG_TMS: J4.A2(A02)
JTAG_TRST: J4.A10
PWR_FAIL: J4.B1(B01)

### Notes on the sheet
- TODO: Finish setting up DP directive and setup pin swapping

### Library data of the parts
J4 = ASP-134486-01: as J3 on sheet HPCC_Connector_A; Manufacturer Part Number: ASP-134486-01

## Sheet FPGA_Power.SchDoc
size B; SheetNumber: 6; SheetTotal: 11
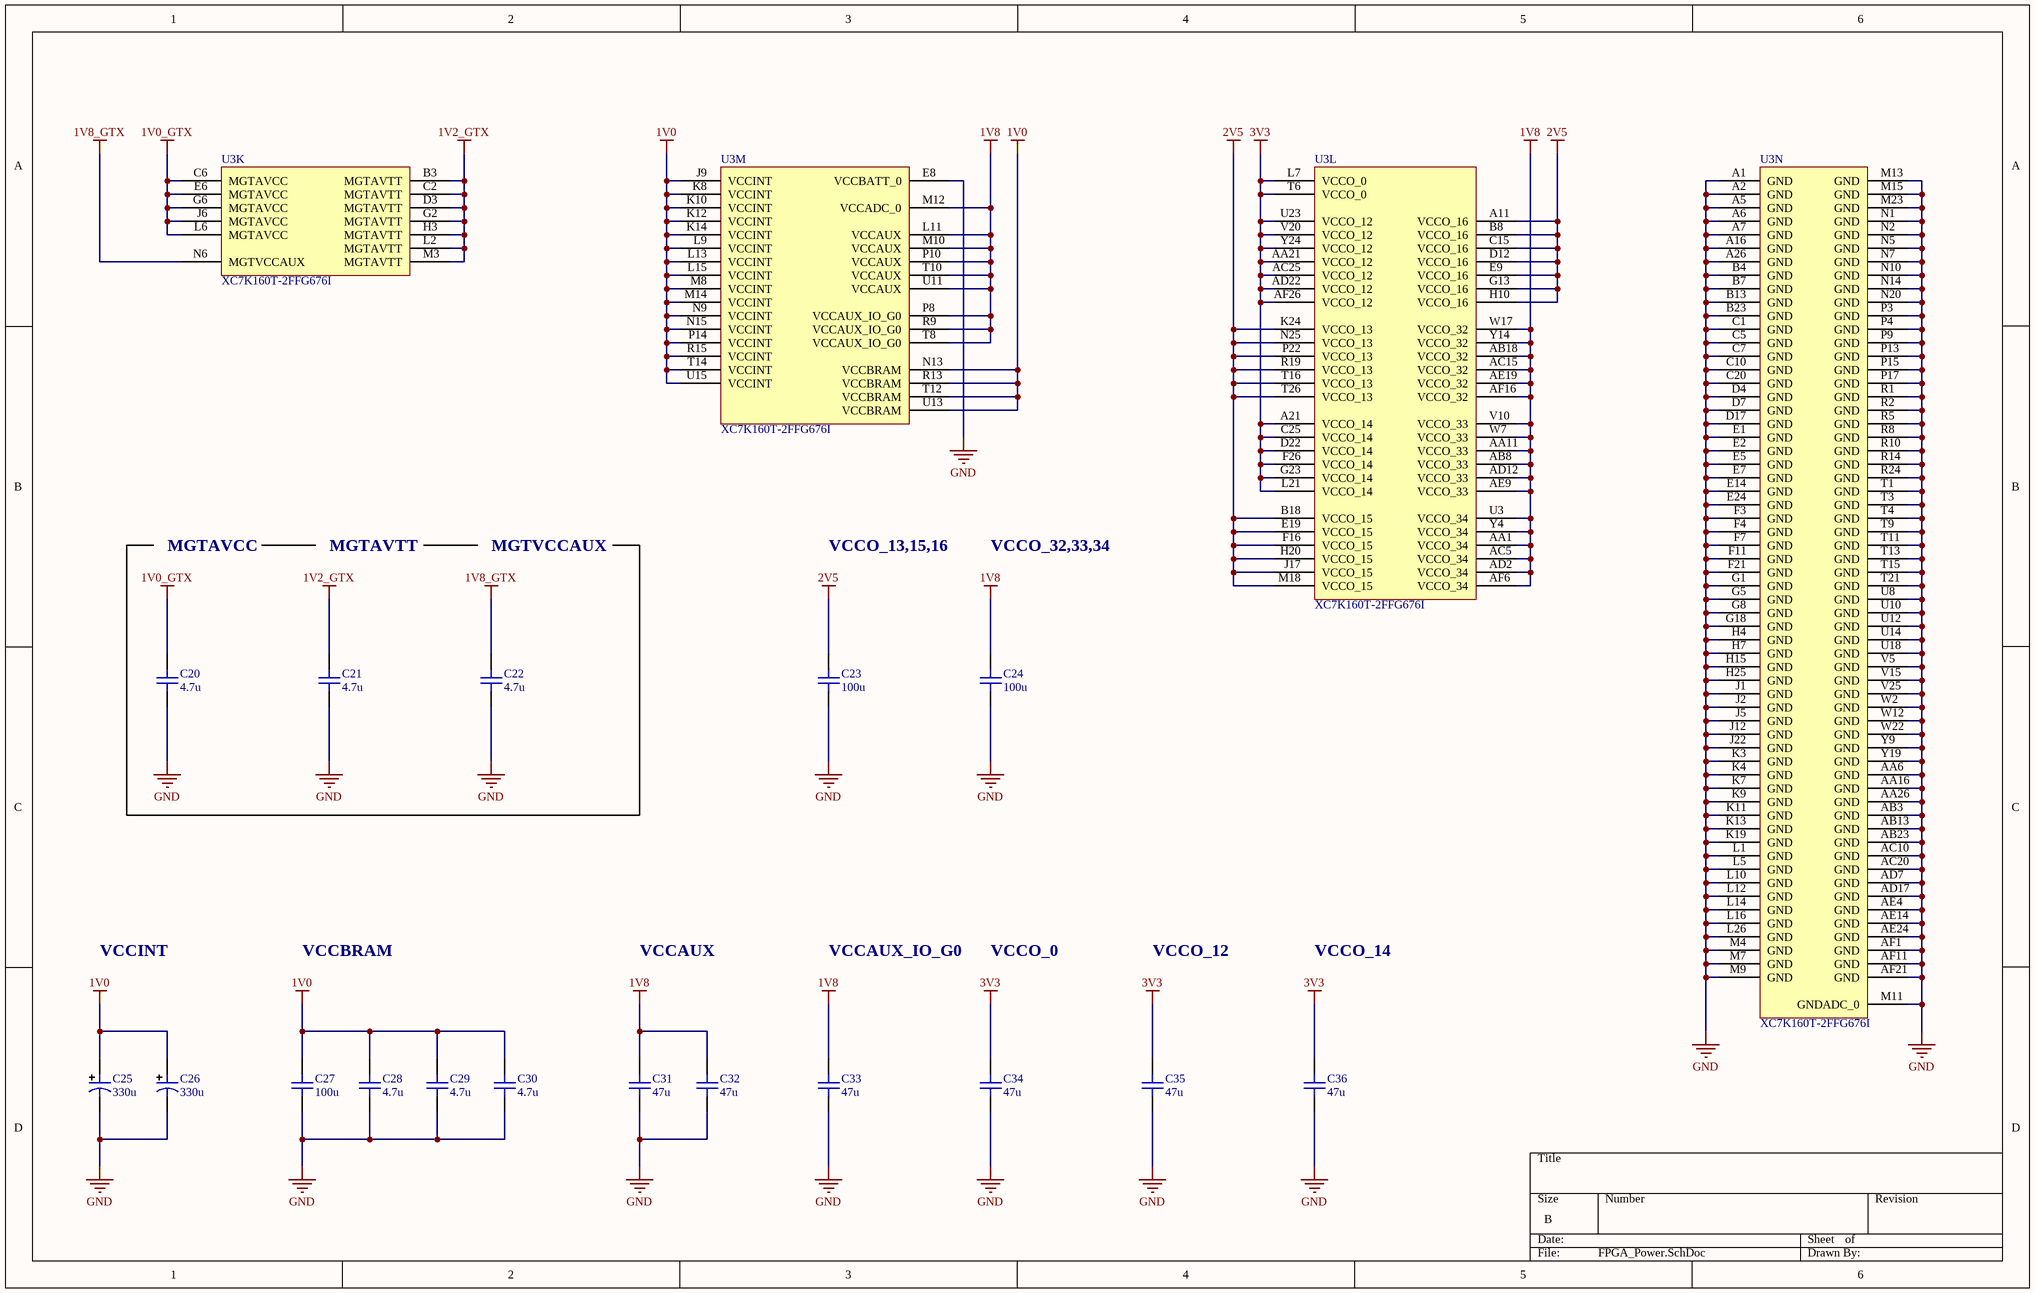
[diagram p5: FPGA_Power.SchDoc]

### Parts
C20  4.7u  [C_0402_Generic]
C21  4.7u  [C_0402_Generic]
C22  4.7u  [C_0402_Generic]
C23  100u  [C_0805_Generic]
C24  100u  [C_0805_Generic]
C25  330u  [C_TANT_EIA-3528-21_B]
C26  330u  [C_TANT_EIA-3528-21_B]
C27  100u  [C_0805_Generic]
C28  4.7u  [C_0402_Generic]
C29  4.7u  [C_0402_Generic]
C30  4.7u  [C_0402_Generic]
C31  47u  [C_0603_Generic]
C32  47u  [C_0603_Generic]
C33  47u  [C_0603_Generic]
C34  47u  [C_0603_Generic]
C35  47u  [C_0603_Generic]
C36  47u  [C_0603_Generic]
U3  XC7K160T-2FFG676I  [FFG676_(XC7K160T-2FFG676I)]  (parts K,L,M,N of 14)

### Nets
1V0: C25.1 C26.1 C27.2 C28.2 C29.2 C30.2 U3.J9(VCCINT) U3.K8(VCCINT) U3.K10(VCCINT) U3.K12(VCCINT) U3.K14(VCCINT) U3.L9(VCCINT) U3.L13(VCCINT) U3.L15(VCCINT) U3.M8(VCCINT) U3.M14(VCCINT) U3.N9(VCCINT) U3.N13(VCCBRAM) U3.N15(VCCINT) U3.P14(VCCINT) U3.R13(VCCBRAM) U3.R15(VCCINT) U3.T12(VCCBRAM) U3.T14(VCCINT) U3.U13(VCCBRAM) U3.U15(VCCINT)
1V0_GTX: C20.2 U3.C6(MGTAVCC) U3.E6(MGTAVCC) U3.G6(MGTAVCC) U3.J6(MGTAVCC) U3.L6(MGTAVCC)
1V2_GTX: C21.2 U3.B3(MGTAVTT) U3.C2(MGTAVTT) U3.D3(MGTAVTT) U3.G2(MGTAVTT) U3.H3(MGTAVTT) U3.L2(MGTAVTT) U3.M3(MGTAVTT)
1V8: C24.2 C31.2 C32.2 C33.2 U3.AA1(VCCO_34) U3.AA11(VCCO_33) U3.AB8(VCCO_33) U3.AB18(VCCO_32) U3.AC5(VCCO_34) U3.AC15(VCCO_32) U3.AD2(VCCO_34) U3.AD12(VCCO_33) U3.AE9(VCCO_33) U3.AE19(VCCO_32) U3.AF6(VCCO_34) U3.AF16(VCCO_32) U3.L11(VCCAUX) U3.M10(VCCAUX) U3.M12(VCCADC_0) U3.P8(VCCAUX_IO_G0) U3.P10(VCCAUX) U3.R9(VCCAUX_IO_G0) U3.T8(VCCAUX_IO_G0) U3.T10(VCCAUX) U3.U3(VCCO_34) U3.U11(VCCAUX) U3.V10(VCCO_33) U3.W7(VCCO_33) U3.W17(VCCO_32) U3.Y4(VCCO_34) U3.Y14(VCCO_32)
1V8_GTX: C22.2 U3.N6(MGTVCCAUX)
2V5: C23.2 U3.A11(VCCO_16) U3.B8(VCCO_16) U3.B18(VCCO_15) U3.C15(VCCO_16) U3.D12(VCCO_16) U3.E9(VCCO_16) U3.E19(VCCO_15) U3.F16(VCCO_15) U3.G13(VCCO_16) U3.H10(VCCO_16) U3.H20(VCCO_15) U3.J17(VCCO_15) U3.K24(VCCO_13) U3.M18(VCCO_15) U3.N25(VCCO_13) U3.P22(VCCO_13) U3.R19(VCCO_13) U3.T16(VCCO_13) U3.T26(VCCO_13)
3V3: C34.2 C35.2 C36.2 U3.A21(VCCO_14) U3.AA21(VCCO_12) U3.AC25(VCCO_12) U3.AD22(VCCO_12) U3.AF26(VCCO_12) U3.C25(VCCO_14) U3.D22(VCCO_14) U3.F26(VCCO_14) U3.G23(VCCO_14) U3.L7(VCCO_0) U3.L21(VCCO_14) U3.T6(VCCO_0) U3.U23(VCCO_12) U3.V20(VCCO_12) U3.Y24(VCCO_12)
GND: C20.1 C21.1 C22.1 C23.1 C24.1 C25.2 C26.2 C27.1 C28.1 C29.1 C30.1 C31.1 C32.1 C33.1 C34.1 C35.1 C36.1 U3.A1(GND) U3.A2(GND) U3.A5(GND) U3.A6(GND) U3.A7(GND) U3.A16(GND) U3.A26(GND) U3.AA6(GND) U3.AA16(GND) U3.AA26(GND) U3.AB3(GND) U3.AB13(GND) U3.AB23(GND) U3.AC10(GND) U3.AC20(GND) U3.AD7(GND) U3.AD17(GND) U3.AE4(GND) U3.AE14(GND) U3.AE24(GND) U3.AF1(GND) U3.AF11(GND) U3.AF21(GND) U3.B4(GND) U3.B7(GND) U3.B13(GND) U3.B23(GND) U3.C1(GND) U3.C5(GND) U3.C7(GND) U3.C10(GND) U3.C20(GND) U3.D4(GND) U3.D7(GND) U3.D17(GND) U3.E1(GND) U3.E2(GND) U3.E5(GND) U3.E7(GND) U3.E8(VCCBATT_0) U3.E14(GND) U3.E24(GND) U3.F3(GND) U3.F4(GND) U3.F7(GND) U3.F11(GND) U3.F21(GND) U3.G1(GND) U3.G5(GND) U3.G8(GND) U3.G18(GND) U3.H4(GND) U3.H7(GND) U3.H15(GND) U3.H25(GND) U3.J1(GND) U3.J2(GND) U3.J5(GND) U3.J12(GND) U3.J22(GND) U3.K3(GND) U3.K4(GND) U3.K7(GND) U3.K9(GND) U3.K11(GND) U3.K13(GND) U3.K19(GND) U3.L1(GND) U3.L5(GND) U3.L10(GND) U3.L12(GND) U3.L14(GND) U3.L16(GND) U3.L26(GND) U3.M4(GND) U3.M7(GND) U3.M9(GND) U3.M11(GNDADC_0) U3.M13(GND) U3.M15(GND) U3.M23(GND) U3.N1(GND) U3.N2(GND) U3.N5(GND) U3.N7(GND) U3.N10(GND) U3.N14(GND) U3.N20(GND) U3.P3(GND) U3.P4(GND) U3.P9(GND) U3.P13(GND) U3.P15(GND) U3.P17(GND) U3.R1(GND) U3.R2(GND) U3.R5(GND) U3.R8(GND) U3.R10(GND) U3.R14(GND) U3.R24(GND) U3.T1(GND) U3.T3(GND) U3.T4(GND) U3.T9(GND) U3.T11(GND) U3.T13(GND) U3.T15(GND) U3.T21(GND) U3.U8(GND) U3.U10(GND) U3.U12(GND) U3.U14(GND) U3.U18(GND) U3.V5(GND) U3.V15(GND) U3.V25(GND) U3.W2(GND) U3.W12(GND) U3.W22(GND) U3.Y9(GND) U3.Y19(GND)

### Notes on the sheet
- MGTAVCC
- MGTAVTT
- MGTVCCAUX
- VCCO_13,15,16
- VCCO_32,33,34
- VCCINT
- VCCBRAM
- VCCAUX
- VCCAUX_IO_G0
- VCCO_0
- VCCO_12
- VCCO_14

### Library data of the parts
C20-C22 C28-C30 = GRM155R61A475MEAAJ: 4.7µF 10V X5R SMD ceramic capacitor in 0402 size; Manufacturer: Murata Electronics; Manufacturer Part Number: GRM155R61A475MEAAJ
C23 C24 C27 = GRM21BR60J107ME15L: 100µF 6.3V X5R SMD ceramic capacitor in 0805 size; Manufacturer: Murata Electronics; Manufacturer Part Number: GRM21BR60J107ME15L
C25 C26 = T520B337M2R5ATE015: 330µF 2.5V 15mOhm SMD tantalum capacitor in EIA-3528-21size; Manufacturer: KEMET; Manufacturer Part Number: T520B337M2R5ATE015
C31-C36 = GRM188R60J476ME15D: 47µF 6.3V X5R SMD ceramic capacitor in 0603 size; Manufacturer: Murata Electronics; Manufacturer Part Number: GRM188R60J476ME15D
U3 = XC7K160T: Kintex-7 FPGA, 400 User I/Os, 8 GTX, 676-Ball BGA, Speed Grade 2, Industrial Grade, Pb-Free; Manufacturer: AMD/Xilinx; Manufacturer Part Number: XC7K160T-2FFG676I

## Sheet FPGA_Configuration_JTAG.SchDoc
size B; SheetNumber: 7; SheetTotal: 11
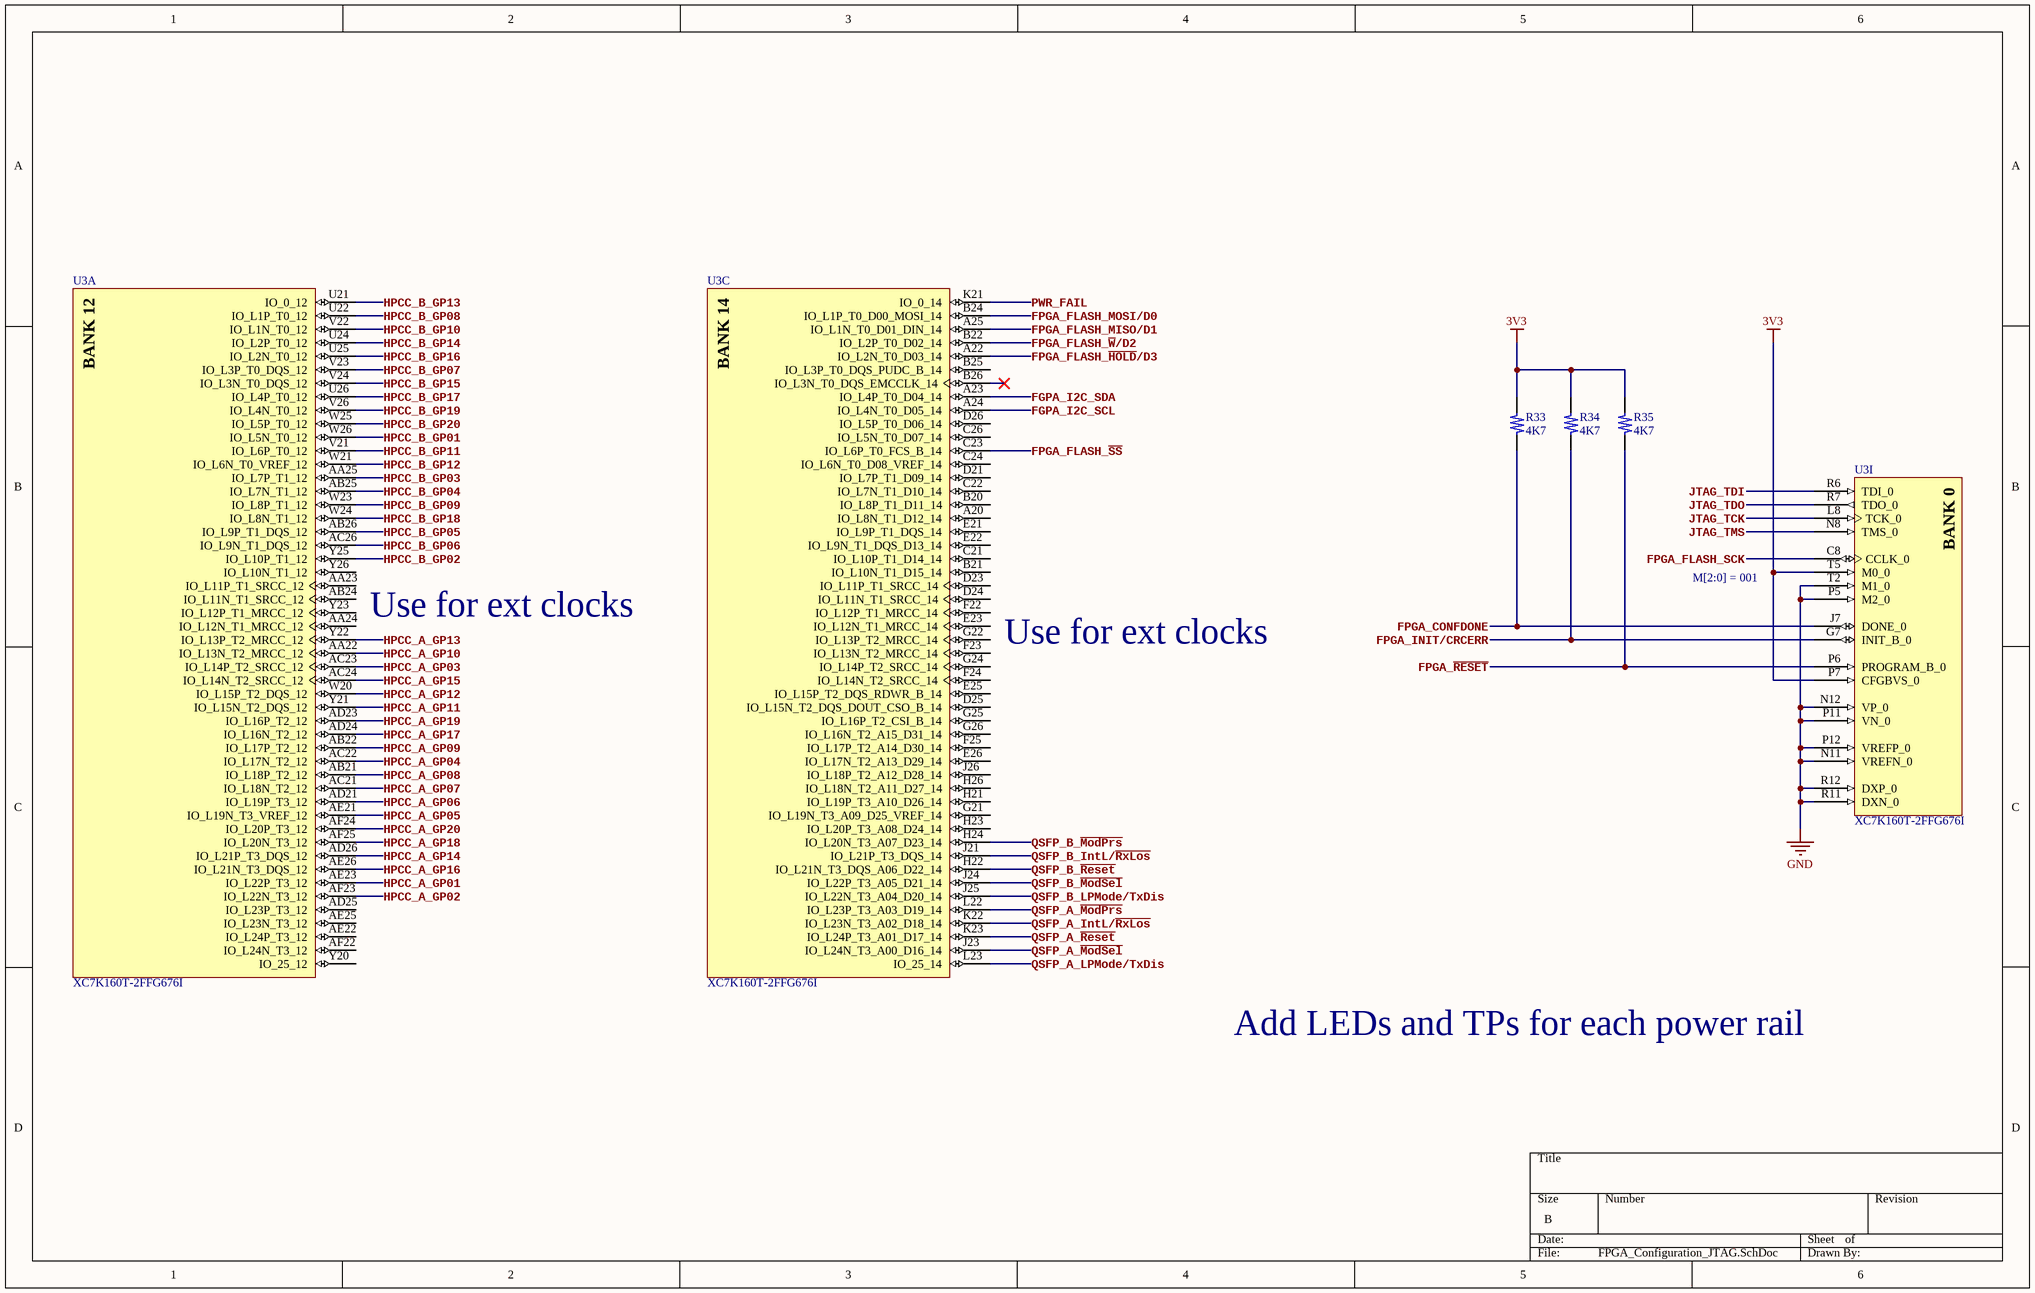
[diagram p6: FPGA_Configuration_JTAG.SchDoc]

### Parts
R33  4K7  [R_0402_Generic]
R34  4K7  [R_0402_Generic]
R35  4K7  [R_0402_Generic]
U3  XC7K160T-2FFG676I  [FFG676_(XC7K160T-2FFG676I)]  (parts A,C,I of 14)

### Nets
3V3: R33.2 R34.2 R35.2 U3.P7(CFGBVS_0) U3.T5(M0_0)
GND: U3.N11(VREFN_0) U3.N12(VP_0) U3.P5(M2_0) U3.P11(VN_0) U3.P12(VREFP_0) U3.R11(DXN_0) U3.R12(DXP_0) U3.T2(M1_0)
FGPA_I2C_SCL: U3.A24(IO_L4N_T0_D05_14)
FGPA_I2C_SDA: U3.A23(IO_L4P_T0_D04_14)
FPGA_CONFDONE: R33.1 U3.J7(DONE_0)
FPGA_FLASH_~{HOLD}/D3: U3.A22(IO_L2N_T0_D03_14)
FPGA_FLASH_MISO/D1: U3.A25(IO_L1N_T0_D01_DIN_14)
FPGA_FLASH_MOSI/D0: U3.B24(IO_L1P_T0_D00_MOSI_14)
FPGA_FLASH_~{SS}: U3.C23(IO_L6P_T0_FCS_B_14)
FPGA_FLASH_SCK: U3.C8(CCLK_0)
FPGA_FLASH_~{W}/D2: U3.B22(IO_L2P_T0_D02_14)
FPGA_INIT/CRCERR: R34.1 U3.G7(INIT_B_0)
FPGA_~{RESET}: R35.1 U3.P6(PROGRAM_B_0)
HPCC_A_GP01: U3.AE23(IO_L22P_T3_12)
HPCC_A_GP02: U3.AF23(IO_L22N_T3_12)
HPCC_A_GP03: U3.AC23(IO_L14P_T2_SRCC_12)
HPCC_A_GP04: U3.AC22(IO_L17N_T2_12)
HPCC_A_GP05: U3.AE21(IO_L19N_T3_VREF_12)
HPCC_A_GP06: U3.AD21(IO_L19P_T3_12)
HPCC_A_GP07: U3.AC21(IO_L18N_T2_12)
HPCC_A_GP08: U3.AB21(IO_L18P_T2_12)
HPCC_A_GP09: U3.AB22(IO_L17P_T2_12)
HPCC_A_GP10: U3.AA22(IO_L13N_T2_MRCC_12)
HPCC_A_GP11: U3.Y21(IO_L15N_T2_DQS_12)
HPCC_A_GP12: U3.W20(IO_L15P_T2_DQS_12)
HPCC_A_GP13: U3.Y22(IO_L13P_T2_MRCC_12)
HPCC_A_GP14: U3.AD26(IO_L21P_T3_DQS_12)
HPCC_A_GP15: U3.AC24(IO_L14N_T2_SRCC_12)
HPCC_A_GP16: U3.AE26(IO_L21N_T3_DQS_12)
HPCC_A_GP17: U3.AD24(IO_L16N_T2_12)
HPCC_A_GP18: U3.AF25(IO_L20N_T3_12)
HPCC_A_GP19: U3.AD23(IO_L16P_T2_12)
HPCC_A_GP20: U3.AF24(IO_L20P_T3_12)
HPCC_B_GP01: U3.W26(IO_L5N_T0_12)
HPCC_B_GP02: U3.Y25(IO_L10P_T1_12)
HPCC_B_GP03: U3.AA25(IO_L7P_T1_12)
HPCC_B_GP04: U3.AB25(IO_L7N_T1_12)
HPCC_B_GP05: U3.AB26(IO_L9P_T1_DQS_12)
HPCC_B_GP06: U3.AC26(IO_L9N_T1_DQS_12)
HPCC_B_GP07: U3.V23(IO_L3P_T0_DQS_12)
HPCC_B_GP08: U3.U22(IO_L1P_T0_12)
HPCC_B_GP09: U3.W23(IO_L8P_T1_12)
HPCC_B_GP10: U3.V22(IO_L1N_T0_12)
HPCC_B_GP11: U3.V21(IO_L6P_T0_12)
HPCC_B_GP12: U3.W21(IO_L6N_T0_VREF_12)
HPCC_B_GP13: U3.U21(IO_0_12)
HPCC_B_GP14: U3.U24(IO_L2P_T0_12)
HPCC_B_GP15: U3.V24(IO_L3N_T0_DQS_12)
HPCC_B_GP16: U3.U25(IO_L2N_T0_12)
HPCC_B_GP17: U3.U26(IO_L4P_T0_12)
HPCC_B_GP18: U3.W24(IO_L8N_T1_12)
HPCC_B_GP19: U3.V26(IO_L4N_T0_12)
HPCC_B_GP20: U3.W25(IO_L5P_T0_12)
JTAG_TCK: U3.L8(TCK_0)
JTAG_TDI: U3.R6(TDI_0)
JTAG_TDO: U3.R7(TDO_0)
JTAG_TMS: U3.N8(TMS_0)
PWR_FAIL: U3.K21(IO_0_14)
QSFP_A_IntL/~{RxLos}: U3.K22(IO_L23N_T3_A02_D18_14)
QSFP_A_LPMode/TxDis: U3.L23(IO_25_14)
QSFP_A_~{ModPrs}: U3.L22(IO_L23P_T3_A03_D19_14)
QSFP_A_~{ModSel}: U3.J23(IO_L24N_T3_A00_D16_14)
QSFP_A_~{Reset}: U3.K23(IO_L24P_T3_A01_D17_14)
QSFP_B_IntL/~{RxLos}: U3.J21(IO_L21P_T3_DQS_14)
QSFP_B_LPMode/TxDis: U3.J25(IO_L22N_T3_A04_D20_14)
QSFP_B_~{ModPrs}: U3.H24(IO_L20N_T3_A07_D23_14)
QSFP_B_~{ModSel}: U3.J24(IO_L22P_T3_A05_D21_14)
QSFP_B_~{Reset}: U3.H22(IO_L21N_T3_DQS_A06_D22_14)

Not connected (* = marked no-connect by the designer): U3 A20(IO_L8N_T1_D12_14) AA23(IO_L11P_T1_SRCC_12) AA24(IO_L12N_T1_MRCC_12) AB24(IO_L11N_T1_SRCC_12) AD25(IO_L23P_T3_12) AE22(IO_L24P_T3_12) AE25(IO_L23N_T3_12) AF22(IO_L24N_T3_12) B20(IO_L8P_T1_D11_14) B21(IO_L10N_T1_D15_14) B25(IO_L3P_T0_DQS_PUDC_B_14) B26(IO_L3N_T0_DQS_EMCCLK_14)* C21(IO_L10P_T1_D14_14) C22(IO_L7N_T1_D10_14) C24(IO_L6N_T0_D08_VREF_14) C26(IO_L5N_T0_D07_14) D21(IO_L7P_T1_D09_14) D23(IO_L11P_T1_SRCC_14) D24(IO_L11N_T1_SRCC_14) D25(IO_L15N_T2_DQS_DOUT_CSO_B_14) D26(IO_L5P_T0_D06_14) E21(IO_L9P_T1_DQS_14) E22(IO_L9N_T1_DQS_D13_14) E23(IO_L12N_T1_MRCC_14) E25(IO_L15P_T2_DQS_RDWR_B_14) E26(IO_L17N_T2_A13_D29_14) F22(IO_L12P_T1_MRCC_14) F23(IO_L13N_T2_MRCC_14) F24(IO_L14N_T2_SRCC_14) F25(IO_L17P_T2_A14_D30_14) G21(IO_L19N_T3_A09_D25_VREF_14) G22(IO_L13P_T2_MRCC_14) G24(IO_L14P_T2_SRCC_14) G25(IO_L16P_T2_CSI_B_14) G26(IO_L16N_T2_A15_D31_14) H21(IO_L19P_T3_A10_D26_14) H23(IO_L20P_T3_A08_D24_14) H26(IO_L18N_T2_A11_D27_14) J26(IO_L18P_T2_A12_D28_14) Y20(IO_25_12) Y23(IO_L12P_T1_MRCC_12) Y26(IO_L10N_T1_12)

### Notes on the sheet
- BANK 0
- Use for ext clocks
- M[2:0] = 001
- Add LEDs and TPs for each power rail
- (in symbol XC7K160T, part A) BANK 12
- (in symbol XC7K160T, part C) BANK 14

### Library data of the parts
R33-R35 = ERJ-2RKF4701X: as R1 on sheet FPGA_FLASH; Manufacturer Part Number: ERJ-2RKF4701X
U3 = XC7K160T: as U3 on sheet FPGA_Power; Manufacturer Part Number: XC7K160T-2FFG676I

## Sheet FPGA_HPCC_B_BG13-15-16.SchDoc
size B; SheetNumber: 8; SheetTotal: 11
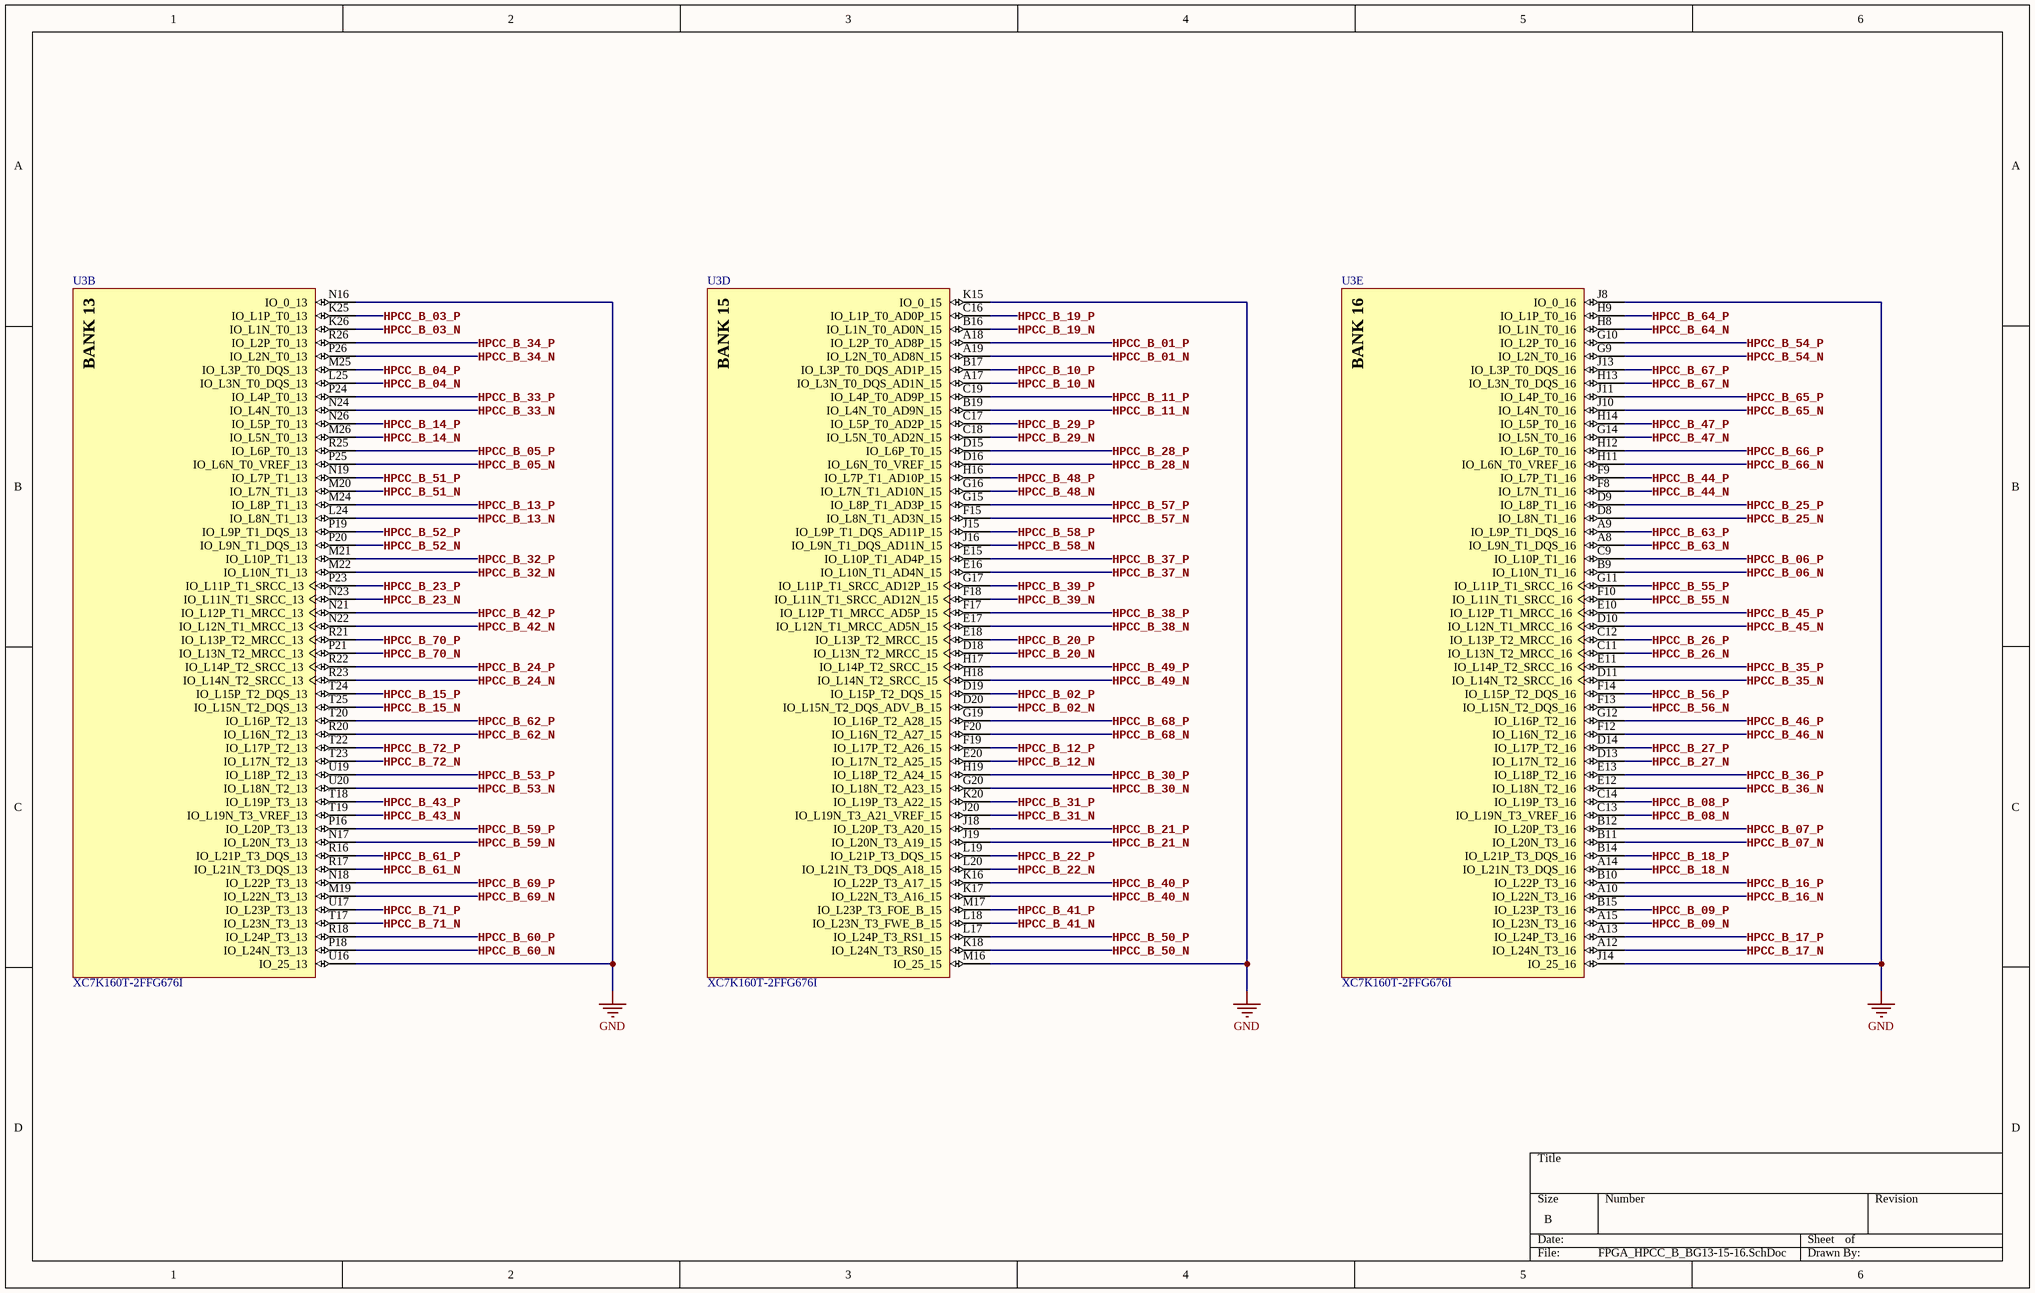
[diagram p7: FPGA_HPCC_B_BG13-15-16.SchDoc]

### Parts
U3  XC7K160T-2FFG676I  [FFG676_(XC7K160T-2FFG676I)]  (parts B,D,E of 14)

### Nets
GND: U3.J8(IO_0_16) U3.J14(IO_25_16) U3.K15(IO_0_15) U3.M16(IO_25_15) U3.N16(IO_0_13) U3.U16(IO_25_13)
HPCC_B_01_N: U3.A19(IO_L2N_T0_AD8N_15)
HPCC_B_01_P: U3.A18(IO_L2P_T0_AD8P_15)
HPCC_B_02_N: U3.D20(IO_L15N_T2_DQS_ADV_B_15)
HPCC_B_02_P: U3.D19(IO_L15P_T2_DQS_15)
HPCC_B_03_N: U3.K26(IO_L1N_T0_13)
HPCC_B_03_P: U3.K25(IO_L1P_T0_13)
HPCC_B_04_N: U3.L25(IO_L3N_T0_DQS_13)
HPCC_B_04_P: U3.M25(IO_L3P_T0_DQS_13)
HPCC_B_05_N: U3.P25(IO_L6N_T0_VREF_13)
HPCC_B_05_P: U3.R25(IO_L6P_T0_13)
HPCC_B_06_N: U3.B9(IO_L10N_T1_16)
HPCC_B_06_P: U3.C9(IO_L10P_T1_16)
HPCC_B_07_N: U3.B11(IO_L20N_T3_16)
HPCC_B_07_P: U3.B12(IO_L20P_T3_16)
HPCC_B_08_N: U3.C13(IO_L19N_T3_VREF_16)
HPCC_B_08_P: U3.C14(IO_L19P_T3_16)
HPCC_B_09_N: U3.A15(IO_L23N_T3_16)
HPCC_B_09_P: U3.B15(IO_L23P_T3_16)
HPCC_B_10_N: U3.A17(IO_L3N_T0_DQS_AD1N_15)
HPCC_B_10_P: U3.B17(IO_L3P_T0_DQS_AD1P_15)
HPCC_B_11_N: U3.B19(IO_L4N_T0_AD9N_15)
HPCC_B_11_P: U3.C19(IO_L4P_T0_AD9P_15)
HPCC_B_12_N: U3.E20(IO_L17N_T2_A25_15)
HPCC_B_12_P: U3.F19(IO_L17P_T2_A26_15)
HPCC_B_13_N: U3.L24(IO_L8N_T1_13)
HPCC_B_13_P: U3.M24(IO_L8P_T1_13)
HPCC_B_14_N: U3.M26(IO_L5N_T0_13)
HPCC_B_14_P: U3.N26(IO_L5P_T0_13)
HPCC_B_15_N: U3.T25(IO_L15N_T2_DQS_13)
HPCC_B_15_P: U3.T24(IO_L15P_T2_DQS_13)
HPCC_B_16_N: U3.A10(IO_L22N_T3_16)
HPCC_B_16_P: U3.B10(IO_L22P_T3_16)
HPCC_B_17_N: U3.A12(IO_L24N_T3_16)
HPCC_B_17_P: U3.A13(IO_L24P_T3_16)
HPCC_B_18_N: U3.A14(IO_L21N_T3_DQS_16)
HPCC_B_18_P: U3.B14(IO_L21P_T3_DQS_16)
HPCC_B_19_N: U3.B16(IO_L1N_T0_AD0N_15)
HPCC_B_19_P: U3.C16(IO_L1P_T0_AD0P_15)
HPCC_B_20_N: U3.D18(IO_L13N_T2_MRCC_15)
HPCC_B_20_P: U3.E18(IO_L13P_T2_MRCC_15)
HPCC_B_21_N: U3.J19(IO_L20N_T3_A19_15)
HPCC_B_21_P: U3.J18(IO_L20P_T3_A20_15)
HPCC_B_22_N: U3.L20(IO_L21N_T3_DQS_A18_15)
HPCC_B_22_P: U3.L19(IO_L21P_T3_DQS_15)
HPCC_B_23_N: U3.N23(IO_L11N_T1_SRCC_13)
HPCC_B_23_P: U3.P23(IO_L11P_T1_SRCC_13)
HPCC_B_24_N: U3.R23(IO_L14N_T2_SRCC_13)
HPCC_B_24_P: U3.R22(IO_L14P_T2_SRCC_13)
HPCC_B_25_N: U3.D8(IO_L8N_T1_16)
HPCC_B_25_P: U3.D9(IO_L8P_T1_16)
HPCC_B_26_N: U3.C11(IO_L13N_T2_MRCC_16)
HPCC_B_26_P: U3.C12(IO_L13P_T2_MRCC_16)
HPCC_B_27_N: U3.D13(IO_L17N_T2_16)
HPCC_B_27_P: U3.D14(IO_L17P_T2_16)
HPCC_B_28_N: U3.D16(IO_L6N_T0_VREF_15)
HPCC_B_28_P: U3.D15(IO_L6P_T0_15)
HPCC_B_29_N: U3.C18(IO_L5N_T0_AD2N_15)
HPCC_B_29_P: U3.C17(IO_L5P_T0_AD2P_15)
HPCC_B_30_N: U3.G20(IO_L18N_T2_A23_15)
HPCC_B_30_P: U3.H19(IO_L18P_T2_A24_15)
HPCC_B_31_N: U3.J20(IO_L19N_T3_A21_VREF_15)
HPCC_B_31_P: U3.K20(IO_L19P_T3_A22_15)
HPCC_B_32_N: U3.M22(IO_L10N_T1_13)
HPCC_B_32_P: U3.M21(IO_L10P_T1_13)
HPCC_B_33_N: U3.N24(IO_L4N_T0_13)
HPCC_B_33_P: U3.P24(IO_L4P_T0_13)
HPCC_B_34_N: U3.P26(IO_L2N_T0_13)
HPCC_B_34_P: U3.R26(IO_L2P_T0_13)
HPCC_B_35_N: U3.D11(IO_L14N_T2_SRCC_16)
HPCC_B_35_P: U3.E11(IO_L14P_T2_SRCC_16)
HPCC_B_36_N: U3.E12(IO_L18N_T2_16)
HPCC_B_36_P: U3.E13(IO_L18P_T2_16)
HPCC_B_37_N: U3.E16(IO_L10N_T1_AD4N_15)
HPCC_B_37_P: U3.E15(IO_L10P_T1_AD4P_15)
HPCC_B_38_N: U3.E17(IO_L12N_T1_MRCC_AD5N_15)
HPCC_B_38_P: U3.F17(IO_L12P_T1_MRCC_AD5P_15)
HPCC_B_39_N: U3.F18(IO_L11N_T1_SRCC_AD12N_15)
HPCC_B_39_P: U3.G17(IO_L11P_T1_SRCC_AD12P_15)
HPCC_B_40_N: U3.K17(IO_L22N_T3_A16_15)
HPCC_B_40_P: U3.K16(IO_L22P_T3_A17_15)
HPCC_B_41_N: U3.L18(IO_L23N_T3_FWE_B_15)
HPCC_B_41_P: U3.M17(IO_L23P_T3_FOE_B_15)
HPCC_B_42_N: U3.N22(IO_L12N_T1_MRCC_13)
HPCC_B_42_P: U3.N21(IO_L12P_T1_MRCC_13)
HPCC_B_43_N: U3.T19(IO_L19N_T3_VREF_13)
HPCC_B_43_P: U3.T18(IO_L19P_T3_13)
HPCC_B_44_N: U3.F8(IO_L7N_T1_16)
HPCC_B_44_P: U3.F9(IO_L7P_T1_16)
HPCC_B_45_N: U3.D10(IO_L12N_T1_MRCC_16)
HPCC_B_45_P: U3.E10(IO_L12P_T1_MRCC_16)
HPCC_B_46_N: U3.F12(IO_L16N_T2_16)
HPCC_B_46_P: U3.G12(IO_L16P_T2_16)
HPCC_B_47_N: U3.G14(IO_L5N_T0_16)
HPCC_B_47_P: U3.H14(IO_L5P_T0_16)
HPCC_B_48_N: U3.G16(IO_L7N_T1_AD10N_15)
HPCC_B_48_P: U3.H16(IO_L7P_T1_AD10P_15)
HPCC_B_49_N: U3.H18(IO_L14N_T2_SRCC_15)
HPCC_B_49_P: U3.H17(IO_L14P_T2_SRCC_15)
HPCC_B_50_N: U3.K18(IO_L24N_T3_RS0_15)
HPCC_B_50_P: U3.L17(IO_L24P_T3_RS1_15)
HPCC_B_51_N: U3.M20(IO_L7N_T1_13)
HPCC_B_51_P: U3.N19(IO_L7P_T1_13)
HPCC_B_52_N: U3.P20(IO_L9N_T1_DQS_13)
HPCC_B_52_P: U3.P19(IO_L9P_T1_DQS_13)
HPCC_B_53_N: U3.U20(IO_L18N_T2_13)
HPCC_B_53_P: U3.U19(IO_L18P_T2_13)
HPCC_B_54_N: U3.G9(IO_L2N_T0_16)
HPCC_B_54_P: U3.G10(IO_L2P_T0_16)
HPCC_B_55_N: U3.F10(IO_L11N_T1_SRCC_16)
HPCC_B_55_P: U3.G11(IO_L11P_T1_SRCC_16)
HPCC_B_56_N: U3.F13(IO_L15N_T2_DQS_16)
HPCC_B_56_P: U3.F14(IO_L15P_T2_DQS_16)
HPCC_B_57_N: U3.F15(IO_L8N_T1_AD3N_15)
HPCC_B_57_P: U3.G15(IO_L8P_T1_AD3P_15)
HPCC_B_58_N: U3.J16(IO_L9N_T1_DQS_AD11N_15)
HPCC_B_58_P: U3.J15(IO_L9P_T1_DQS_AD11P_15)
HPCC_B_59_N: U3.N17(IO_L20N_T3_13)
HPCC_B_59_P: U3.P16(IO_L20P_T3_13)
HPCC_B_60_N: U3.P18(IO_L24N_T3_13)
HPCC_B_60_P: U3.R18(IO_L24P_T3_13)
HPCC_B_61_N: U3.R17(IO_L21N_T3_DQS_13)
HPCC_B_61_P: U3.R16(IO_L21P_T3_DQS_13)
HPCC_B_62_N: U3.R20(IO_L16N_T2_13)
HPCC_B_62_P: U3.T20(IO_L16P_T2_13)
HPCC_B_63_N: U3.A8(IO_L9N_T1_DQS_16)
HPCC_B_63_P: U3.A9(IO_L9P_T1_DQS_16)
HPCC_B_64_N: U3.H8(IO_L1N_T0_16)
HPCC_B_64_P: U3.H9(IO_L1P_T0_16)
HPCC_B_65_N: U3.J10(IO_L4N_T0_16)
HPCC_B_65_P: U3.J11(IO_L4P_T0_16)
HPCC_B_66_N: U3.H11(IO_L6N_T0_VREF_16)
HPCC_B_66_P: U3.H12(IO_L6P_T0_16)
HPCC_B_67_N: U3.H13(IO_L3N_T0_DQS_16)
HPCC_B_67_P: U3.J13(IO_L3P_T0_DQS_16)
HPCC_B_68_N: U3.F20(IO_L16N_T2_A27_15)
HPCC_B_68_P: U3.G19(IO_L16P_T2_A28_15)
HPCC_B_69_N: U3.M19(IO_L22N_T3_13)
HPCC_B_69_P: U3.N18(IO_L22P_T3_13)
HPCC_B_70_N: U3.P21(IO_L13N_T2_MRCC_13)
HPCC_B_70_P: U3.R21(IO_L13P_T2_MRCC_13)
HPCC_B_71_N: U3.T17(IO_L23N_T3_13)
HPCC_B_71_P: U3.U17(IO_L23P_T3_13)
HPCC_B_72_N: U3.T23(IO_L17N_T2_13)
HPCC_B_72_P: U3.T22(IO_L17P_T2_13)

### Notes on the sheet
- (in symbol XC7K160T, part B) BANK 13
- (in symbol XC7K160T, part D) BANK 15
- (in symbol XC7K160T, part E) BANK 16

### Library data of the parts
U3 = XC7K160T: as U3 on sheet FPGA_Power; Manufacturer Part Number: XC7K160T-2FFG676I

## Sheet FPGA_HPCC_A_BG33-34-35.SchDoc
size B; SheetNumber: 9; SheetTotal: 11
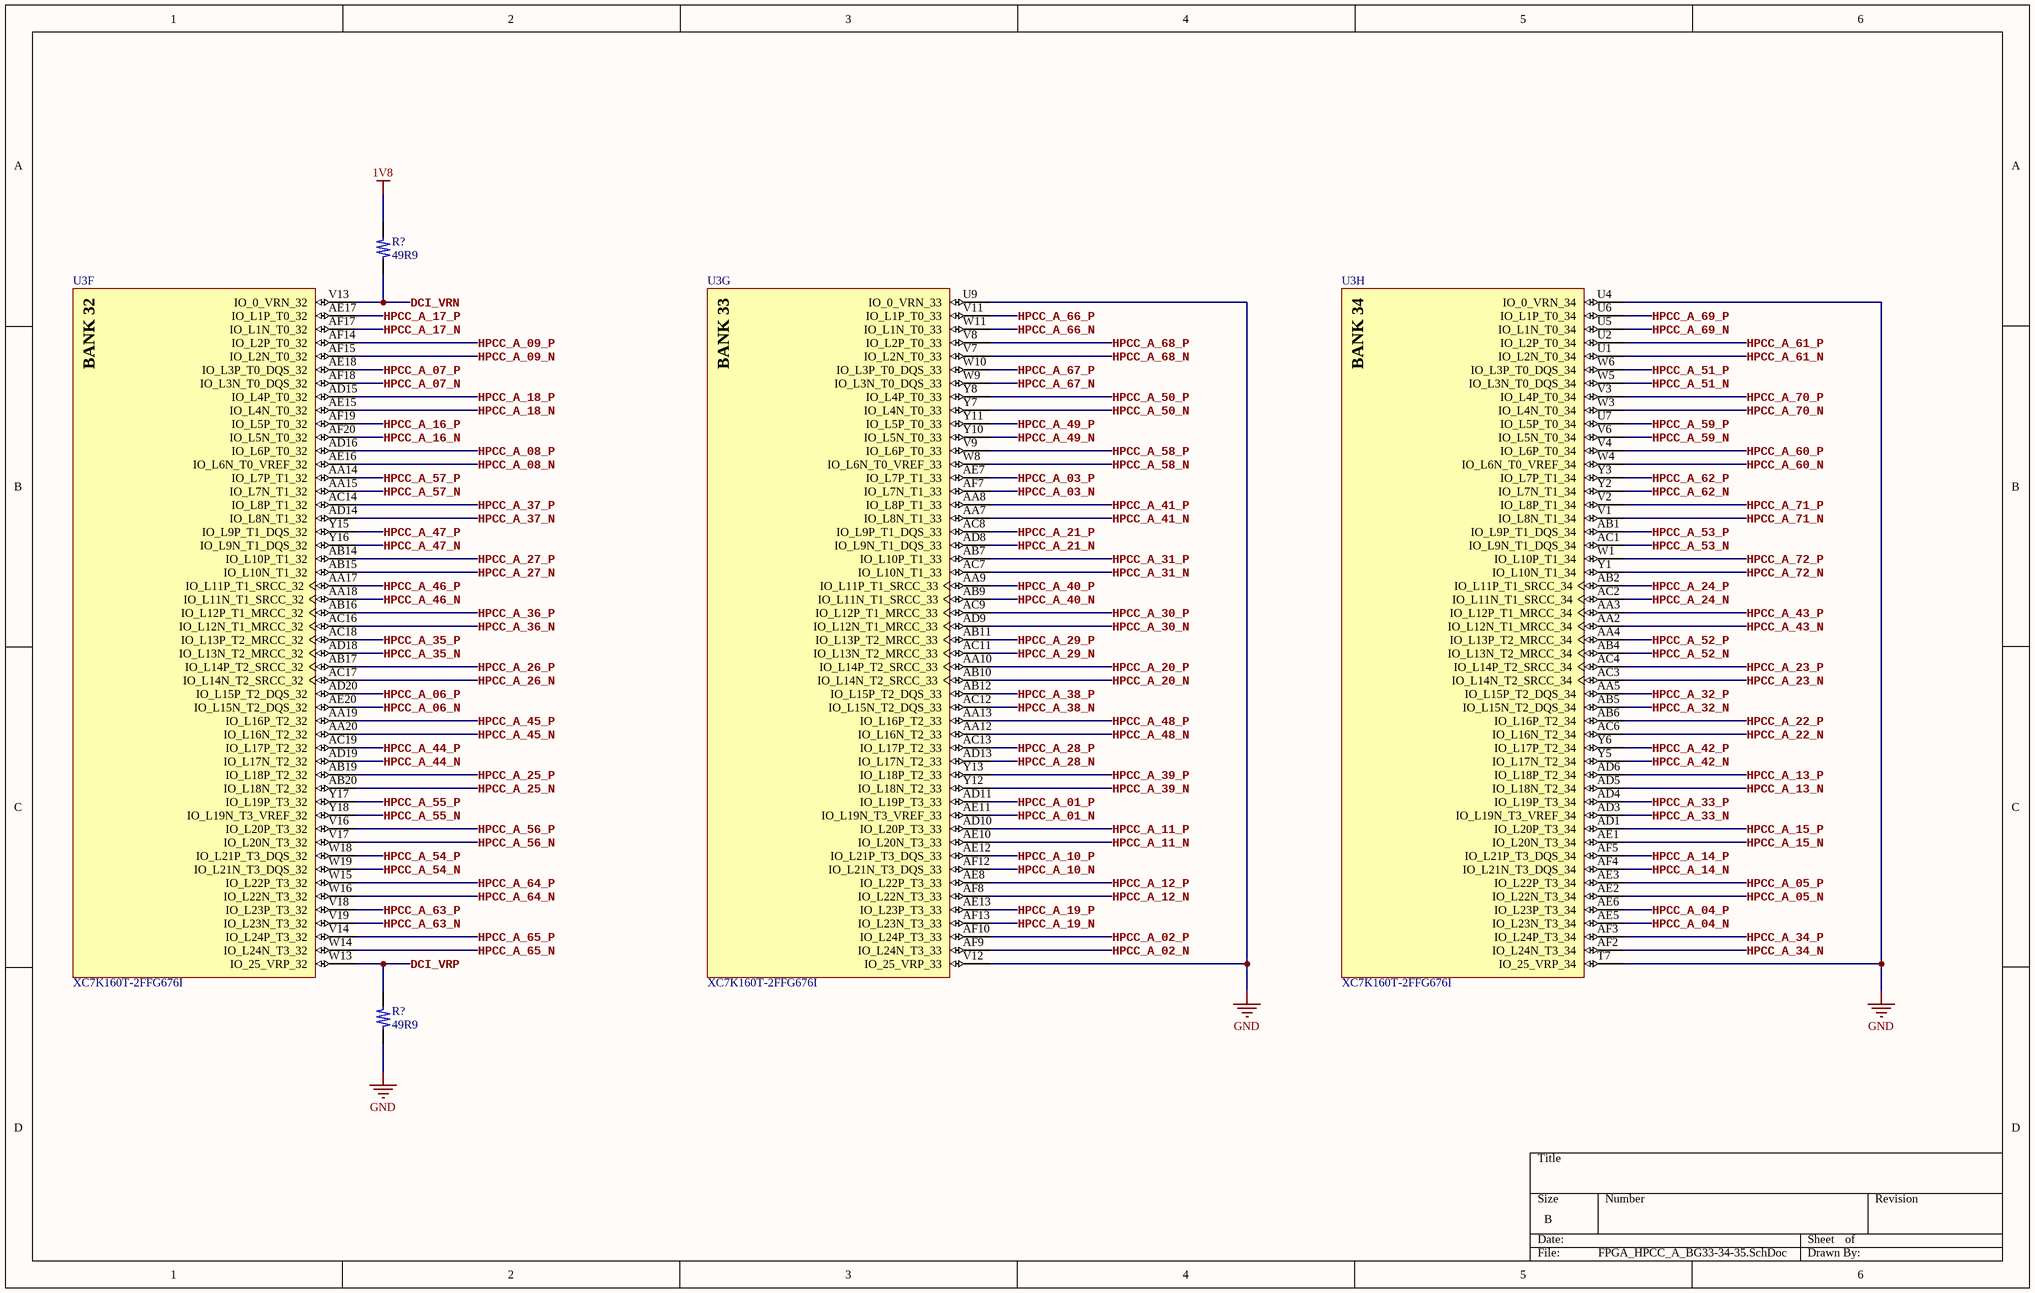
[diagram p8: FPGA_HPCC_A_BG33-34-35.SchDoc]

### Parts
(Parts that share a designator on the sheet are numbered #1, #2 ... from top to bottom, then left to right.)
R?#3  49R9  [R_0402_Generic]
R?#4  49R9  [R_0402_Generic]
U3  XC7K160T-2FFG676I  [FFG676_(XC7K160T-2FFG676I)]  (parts F,G,H of 14)

### Nets
1V8: R?#3.1
GND: R?#4.2 U3.T7(IO_25_VRP_34) U3.U4(IO_0_VRN_34) U3.U9(IO_0_VRN_33) U3.V12(IO_25_VRP_33)
DCI_VRN: R?#3.2 U3.V13(IO_0_VRN_32)
DCI_VRP: R?#4.1 U3.W13(IO_25_VRP_32)
HPCC_A_01_N: U3.AE11(IO_L19N_T3_VREF_33)
HPCC_A_01_P: U3.AD11(IO_L19P_T3_33)
HPCC_A_02_N: U3.AF9(IO_L24N_T3_33)
HPCC_A_02_P: U3.AF10(IO_L24P_T3_33)
HPCC_A_03_N: U3.AF7(IO_L7N_T1_33)
HPCC_A_03_P: U3.AE7(IO_L7P_T1_33)
HPCC_A_04_N: U3.AE5(IO_L23N_T3_34)
HPCC_A_04_P: U3.AE6(IO_L23P_T3_34)
HPCC_A_05_N: U3.AE2(IO_L22N_T3_34)
HPCC_A_05_P: U3.AE3(IO_L22P_T3_34)
HPCC_A_06_N: U3.AE20(IO_L15N_T2_DQS_32)
HPCC_A_06_P: U3.AD20(IO_L15P_T2_DQS_32)
HPCC_A_07_N: U3.AF18(IO_L3N_T0_DQS_32)
HPCC_A_07_P: U3.AE18(IO_L3P_T0_DQS_32)
HPCC_A_08_N: U3.AE16(IO_L6N_T0_VREF_32)
HPCC_A_08_P: U3.AD16(IO_L6P_T0_32)
HPCC_A_09_N: U3.AF15(IO_L2N_T0_32)
HPCC_A_09_P: U3.AF14(IO_L2P_T0_32)
HPCC_A_10_N: U3.AF12(IO_L21N_T3_DQS_33)
HPCC_A_10_P: U3.AE12(IO_L21P_T3_DQS_33)
HPCC_A_11_N: U3.AE10(IO_L20N_T3_33)
HPCC_A_11_P: U3.AD10(IO_L20P_T3_33)
HPCC_A_12_N: U3.AF8(IO_L22N_T3_33)
HPCC_A_12_P: U3.AE8(IO_L22P_T3_33)
HPCC_A_13_N: U3.AD5(IO_L18N_T2_34)
HPCC_A_13_P: U3.AD6(IO_L18P_T2_34)
HPCC_A_14_N: U3.AF4(IO_L21N_T3_DQS_34)
HPCC_A_14_P: U3.AF5(IO_L21P_T3_DQS_34)
HPCC_A_15_N: U3.AE1(IO_L20N_T3_34)
HPCC_A_15_P: U3.AD1(IO_L20P_T3_34)
HPCC_A_16_N: U3.AF20(IO_L5N_T0_32)
HPCC_A_16_P: U3.AF19(IO_L5P_T0_32)
HPCC_A_17_N: U3.AF17(IO_L1N_T0_32)
HPCC_A_17_P: U3.AE17(IO_L1P_T0_32)
HPCC_A_18_N: U3.AE15(IO_L4N_T0_32)
HPCC_A_18_P: U3.AD15(IO_L4P_T0_32)
HPCC_A_19_N: U3.AF13(IO_L23N_T3_33)
HPCC_A_19_P: U3.AE13(IO_L23P_T3_33)
HPCC_A_20_N: U3.AB10(IO_L14N_T2_SRCC_33)
HPCC_A_20_P: U3.AA10(IO_L14P_T2_SRCC_33)
HPCC_A_21_N: U3.AD8(IO_L9N_T1_DQS_33)
HPCC_A_21_P: U3.AC8(IO_L9P_T1_DQS_33)
HPCC_A_22_N: U3.AC6(IO_L16N_T2_34)
HPCC_A_22_P: U3.AB6(IO_L16P_T2_34)
HPCC_A_23_N: U3.AC3(IO_L14N_T2_SRCC_34)
HPCC_A_23_P: U3.AC4(IO_L14P_T2_SRCC_34)
HPCC_A_24_N: U3.AC2(IO_L11N_T1_SRCC_34)
HPCC_A_24_P: U3.AB2(IO_L11P_T1_SRCC_34)
HPCC_A_25_N: U3.AB20(IO_L18N_T2_32)
HPCC_A_25_P: U3.AB19(IO_L18P_T2_32)
HPCC_A_26_N: U3.AC17(IO_L14N_T2_SRCC_32)
HPCC_A_26_P: U3.AB17(IO_L14P_T2_SRCC_32)
HPCC_A_27_N: U3.AB15(IO_L10N_T1_32)
HPCC_A_27_P: U3.AB14(IO_L10P_T1_32)
HPCC_A_28_N: U3.AD13(IO_L17N_T2_33)
HPCC_A_28_P: U3.AC13(IO_L17P_T2_33)
HPCC_A_29_N: U3.AC11(IO_L13N_T2_MRCC_33)
HPCC_A_29_P: U3.AB11(IO_L13P_T2_MRCC_33)
HPCC_A_30_N: U3.AD9(IO_L12N_T1_MRCC_33)
HPCC_A_30_P: U3.AC9(IO_L12P_T1_MRCC_33)
HPCC_A_31_N: U3.AC7(IO_L10N_T1_33)
HPCC_A_31_P: U3.AB7(IO_L10P_T1_33)
HPCC_A_32_N: U3.AB5(IO_L15N_T2_DQS_34)
HPCC_A_32_P: U3.AA5(IO_L15P_T2_DQS_34)
HPCC_A_33_N: U3.AD3(IO_L19N_T3_VREF_34)
HPCC_A_33_P: U3.AD4(IO_L19P_T3_34)
HPCC_A_34_N: U3.AF2(IO_L24N_T3_34)
HPCC_A_34_P: U3.AF3(IO_L24P_T3_34)
HPCC_A_35_N: U3.AD18(IO_L13N_T2_MRCC_32)
HPCC_A_35_P: U3.AC18(IO_L13P_T2_MRCC_32)
HPCC_A_36_N: U3.AC16(IO_L12N_T1_MRCC_32)
HPCC_A_36_P: U3.AB16(IO_L12P_T1_MRCC_32)
HPCC_A_37_N: U3.AD14(IO_L8N_T1_32)
HPCC_A_37_P: U3.AC14(IO_L8P_T1_32)
HPCC_A_38_N: U3.AC12(IO_L15N_T2_DQS_33)
HPCC_A_38_P: U3.AB12(IO_L15P_T2_DQS_33)
HPCC_A_39_N: U3.Y12(IO_L18N_T2_33)
HPCC_A_39_P: U3.Y13(IO_L18P_T2_33)
HPCC_A_40_N: U3.AB9(IO_L11N_T1_SRCC_33)
HPCC_A_40_P: U3.AA9(IO_L11P_T1_SRCC_33)
HPCC_A_41_N: U3.AA7(IO_L8N_T1_33)
HPCC_A_41_P: U3.AA8(IO_L8P_T1_33)
HPCC_A_42_N: U3.Y5(IO_L17N_T2_34)
HPCC_A_42_P: U3.Y6(IO_L17P_T2_34)
HPCC_A_43_N: U3.AA2(IO_L12N_T1_MRCC_34)
HPCC_A_43_P: U3.AA3(IO_L12P_T1_MRCC_34)
HPCC_A_44_N: U3.AD19(IO_L17N_T2_32)
HPCC_A_44_P: U3.AC19(IO_L17P_T2_32)
HPCC_A_45_N: U3.AA20(IO_L16N_T2_32)
HPCC_A_45_P: U3.AA19(IO_L16P_T2_32)
HPCC_A_46_N: U3.AA18(IO_L11N_T1_SRCC_32)
HPCC_A_46_P: U3.AA17(IO_L11P_T1_SRCC_32)
HPCC_A_47_N: U3.Y16(IO_L9N_T1_DQS_32)
HPCC_A_47_P: U3.Y15(IO_L9P_T1_DQS_32)
HPCC_A_48_N: U3.AA12(IO_L16N_T2_33)
HPCC_A_48_P: U3.AA13(IO_L16P_T2_33)
HPCC_A_49_N: U3.Y10(IO_L5N_T0_33)
HPCC_A_49_P: U3.Y11(IO_L5P_T0_33)
HPCC_A_50_N: U3.Y7(IO_L4N_T0_33)
HPCC_A_50_P: U3.Y8(IO_L4P_T0_33)
HPCC_A_51_N: U3.W5(IO_L3N_T0_DQS_34)
HPCC_A_51_P: U3.W6(IO_L3P_T0_DQS_34)
HPCC_A_52_N: U3.AB4(IO_L13N_T2_MRCC_34)
HPCC_A_52_P: U3.AA4(IO_L13P_T2_MRCC_34)
HPCC_A_53_N: U3.AC1(IO_L9N_T1_DQS_34)
HPCC_A_53_P: U3.AB1(IO_L9P_T1_DQS_34)
HPCC_A_54_N: U3.W19(IO_L21N_T3_DQS_32)
HPCC_A_54_P: U3.W18(IO_L21P_T3_DQS_32)
HPCC_A_55_N: U3.Y18(IO_L19N_T3_VREF_32)
HPCC_A_55_P: U3.Y17(IO_L19P_T3_32)
HPCC_A_56_N: U3.V17(IO_L20N_T3_32)
HPCC_A_56_P: U3.V16(IO_L20P_T3_32)
HPCC_A_57_N: U3.AA15(IO_L7N_T1_32)
HPCC_A_57_P: U3.AA14(IO_L7P_T1_32)
HPCC_A_58_N: U3.W8(IO_L6N_T0_VREF_33)
HPCC_A_58_P: U3.V9(IO_L6P_T0_33)
HPCC_A_59_N: U3.V6(IO_L5N_T0_34)
HPCC_A_59_P: U3.U7(IO_L5P_T0_34)
HPCC_A_60_N: U3.W4(IO_L6N_T0_VREF_34)
HPCC_A_60_P: U3.V4(IO_L6P_T0_34)
HPCC_A_61_N: U3.U1(IO_L2N_T0_34)
HPCC_A_61_P: U3.U2(IO_L2P_T0_34)
HPCC_A_62_N: U3.Y2(IO_L7N_T1_34)
HPCC_A_62_P: U3.Y3(IO_L7P_T1_34)
HPCC_A_63_N: U3.V19(IO_L23N_T3_32)
HPCC_A_63_P: U3.V18(IO_L23P_T3_32)
HPCC_A_64_N: U3.W16(IO_L22N_T3_32)
HPCC_A_64_P: U3.W15(IO_L22P_T3_32)
HPCC_A_65_N: U3.W14(IO_L24N_T3_32)
HPCC_A_65_P: U3.V14(IO_L24P_T3_32)
HPCC_A_66_N: U3.W11(IO_L1N_T0_33)
HPCC_A_66_P: U3.V11(IO_L1P_T0_33)
HPCC_A_67_N: U3.W9(IO_L3N_T0_DQS_33)
HPCC_A_67_P: U3.W10(IO_L3P_T0_DQS_33)
HPCC_A_68_N: U3.V7(IO_L2N_T0_33)
HPCC_A_68_P: U3.V8(IO_L2P_T0_33)
HPCC_A_69_N: U3.U5(IO_L1N_T0_34)
HPCC_A_69_P: U3.U6(IO_L1P_T0_34)
HPCC_A_70_N: U3.W3(IO_L4N_T0_34)
HPCC_A_70_P: U3.V3(IO_L4P_T0_34)
HPCC_A_71_N: U3.V1(IO_L8N_T1_34)
HPCC_A_71_P: U3.V2(IO_L8P_T1_34)
HPCC_A_72_N: U3.Y1(IO_L10N_T1_34)
HPCC_A_72_P: U3.W1(IO_L10P_T1_34)

### Notes on the sheet
- (in symbol XC7K160T, part F) BANK 32
- (in symbol XC7K160T, part G) BANK 33
- (in symbol XC7K160T, part H) BANK 34

### Library data of the parts
R?#3 R?#4 = ERJ-2RKD49R9X: 49.9Ohm 0.5% 1/16W SMD resistor in 0402 size; Manufacturer: Panasonic; Manufacturer Part Number: ERJ-2RKD49R9X
U3 = XC7K160T: as U3 on sheet FPGA_Power; Manufacturer Part Number: XC7K160T-2FFG676I

## Sheet FPGA_GTXqs.SchDoc
size B; SheetNumber: 10; SheetTotal: 11
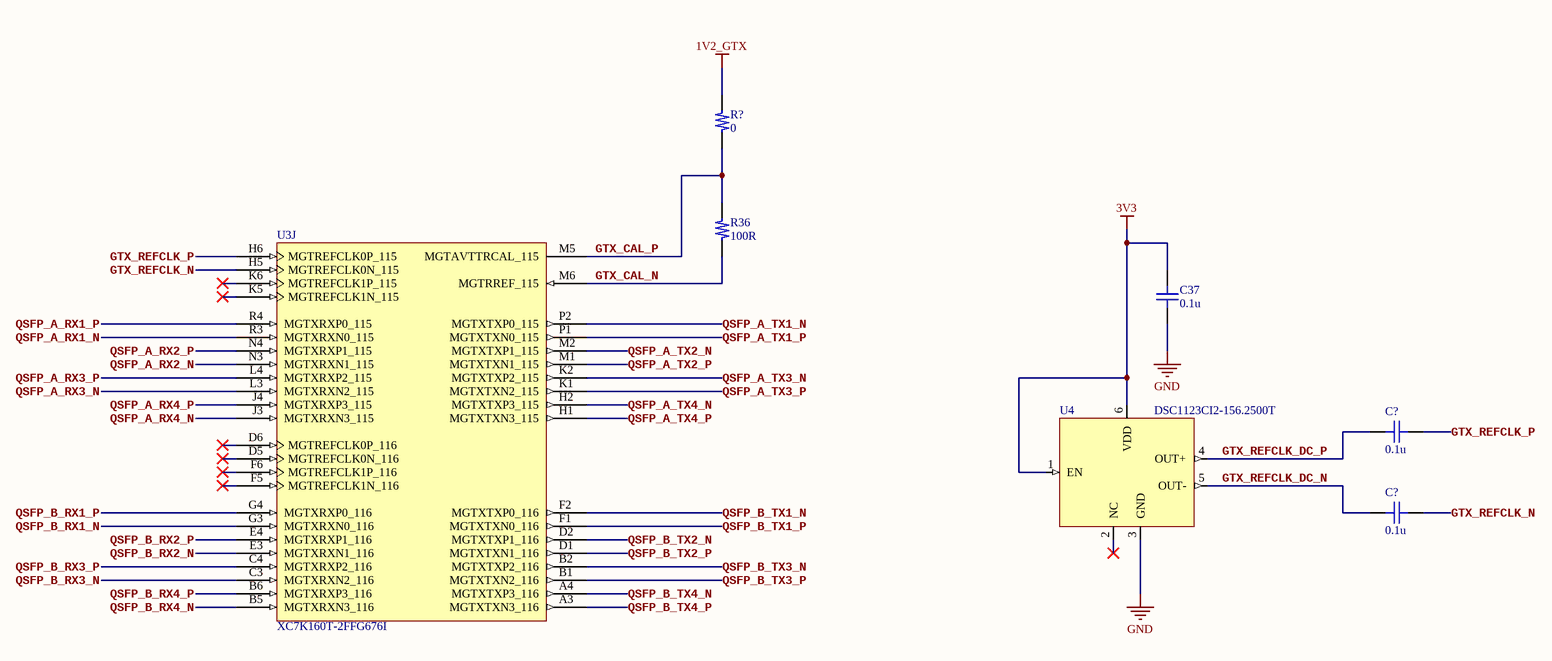
[diagram p9: FPGA_GTXqs.SchDoc]

### Parts
(Parts that share a designator on the sheet are numbered #1, #2 ... from top to bottom, then left to right.)
C37  0.1u  [C_0402_Generic]
C?#1  0.1u  [C_0402_Generic]
C?#2  0.1u  [C_0402_Generic]
R36  100R  [R_0402_Generic]
R?#5  0  [R_0402_Generic]
U3  XC7K160T-2FFG676I  [FFG676_(XC7K160T-2FFG676I)]  (part J of 14)
U4  DSC1123CI2-156.2500T  [Microchip_DSC1123CI2]

### Nets
1V2_GTX: R?#5.2
3V3: C37.2 U4.1(EN) U4.6(VDD)
GND: C37.1 U4.3(GND)
GTX_CAL_N: R36.2 U3.M6(MGTRREF_115)
GTX_CAL_P: R36.1 R?#5.1 U3.M5(MGTAVTTRCAL_115)
GTX_REFCLK_DC_N: C?#2.2 U4.5(OUT-)
GTX_REFCLK_DC_P: C?#1.2 U4.4(OUT+)
GTX_REFCLK_N: C?#2.1 U3.H5(MGTREFCLK0N_115)
GTX_REFCLK_P: C?#1.1 U3.H6(MGTREFCLK0P_115)
QSFP_A_RX1_N: U3.R3(MGTXRXN0_115)
QSFP_A_RX1_P: U3.R4(MGTXRXP0_115)
QSFP_A_RX2_N: U3.N3(MGTXRXN1_115)
QSFP_A_RX2_P: U3.N4(MGTXRXP1_115)
QSFP_A_RX3_N: U3.L3(MGTXRXN2_115)
QSFP_A_RX3_P: U3.L4(MGTXRXP2_115)
QSFP_A_RX4_N: U3.J3(MGTXRXN3_115)
QSFP_A_RX4_P: U3.J4(MGTXRXP3_115)
QSFP_A_TX1_N: U3.P2(MGTXTXP0_115)
QSFP_A_TX1_P: U3.P1(MGTXTXN0_115)
QSFP_A_TX2_N: U3.M2(MGTXTXP1_115)
QSFP_A_TX2_P: U3.M1(MGTXTXN1_115)
QSFP_A_TX3_N: U3.K2(MGTXTXP2_115)
QSFP_A_TX3_P: U3.K1(MGTXTXN2_115)
QSFP_A_TX4_N: U3.H2(MGTXTXP3_115)
QSFP_A_TX4_P: U3.H1(MGTXTXN3_115)
QSFP_B_RX1_N: U3.G3(MGTXRXN0_116)
QSFP_B_RX1_P: U3.G4(MGTXRXP0_116)
QSFP_B_RX2_N: U3.E3(MGTXRXN1_116)
QSFP_B_RX2_P: U3.E4(MGTXRXP1_116)
QSFP_B_RX3_N: U3.C3(MGTXRXN2_116)
QSFP_B_RX3_P: U3.C4(MGTXRXP2_116)
QSFP_B_RX4_N: U3.B5(MGTXRXN3_116)
QSFP_B_RX4_P: U3.B6(MGTXRXP3_116)
QSFP_B_TX1_N: U3.F2(MGTXTXP0_116)
QSFP_B_TX1_P: U3.F1(MGTXTXN0_116)
QSFP_B_TX2_N: U3.D2(MGTXTXP1_116)
QSFP_B_TX2_P: U3.D1(MGTXTXN1_116)
QSFP_B_TX3_N: U3.B2(MGTXTXP2_116)
QSFP_B_TX3_P: U3.B1(MGTXTXN2_116)
QSFP_B_TX4_N: U3.A4(MGTXTXP3_116)
QSFP_B_TX4_P: U3.A3(MGTXTXN3_116)

Not connected (* = marked no-connect by the designer): U3 D5(MGTREFCLK0N_116)* D6(MGTREFCLK0P_116)* F5(MGTREFCLK1N_116)* F6(MGTREFCLK1P_116)* K5(MGTREFCLK1N_115)* K6(MGTREFCLK1P_115)*; U4 2(NC)*

### Library data of the parts
C37 C?#1 C?#2 = GRM155R71C104KA88D: as C1 on sheet FPGA_FLASH; Manufacturer Part Number: GRM155R71C104KA88D
R36 = ERJ-2RHD1000X: 100Ohm 0.5% 1/16W SMD resistor in 0402 size; Manufacturer: Panasonic; Manufacturer Part Number: ERJ-2RHD1000X
R?#5 = ERJ-2GE0R00X: Jumper 0Ohm SMD resistor in 0402 size; Manufacturer: Panasonic; Manufacturer Part Number: ERJ-2GE0R00X
U3 = XC7K160T: as U3 on sheet FPGA_Power; Manufacturer Part Number: XC7K160T-2FFG676I
U4 = DSC1123CI2-156.2500T: MEMS OSC XO 156.2500MHZ LVDS SMD; Manufacturer: Microchip Technology; Manufacturer Part Number: DSC1123CI2-156.2500T

## Sheet Misc_Functions.SchDoc
size B; SheetNumber: 11; SheetTotal: 11
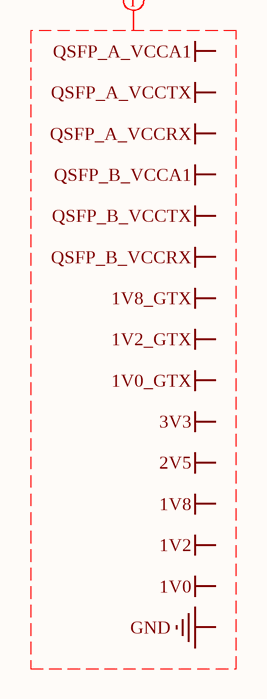
[diagram p10: Misc_Functions.SchDoc]

### Layout directives
net class POWER: 1V0, 1V0_GTX, 1V2, 1V2_GTX, 1V8, 1V8_GTX, 2V5, 3V3, GND, QSFP_A_VCCA1, QSFP_A_VCCRX, QSFP_A_VCCTX, QSFP_B_VCCA1, QSFP_B_VCCRX, QSFP_B_VCCTX

### Notes on the sheet
- Labels drawn without touching a wire or pin: 1V0, 1V0_GTX, 1V2, 1V2_GTX, 1V8, 1V8_GTX, 2V5, 3V3, GND, QSFP_A_VCCA1, QSFP_A_VCCRX, QSFP_A_VCCTX, QSFP_B_VCCA1, QSFP_B_VCCRX, QSFP_B_VCCTX